# EAGLE schematic main (EAGLE 8.7.0)
CNAME: RJ Cunningham

## Sheet 1 of 11: Power Regulation A sheet for all the voltage regulators in use.
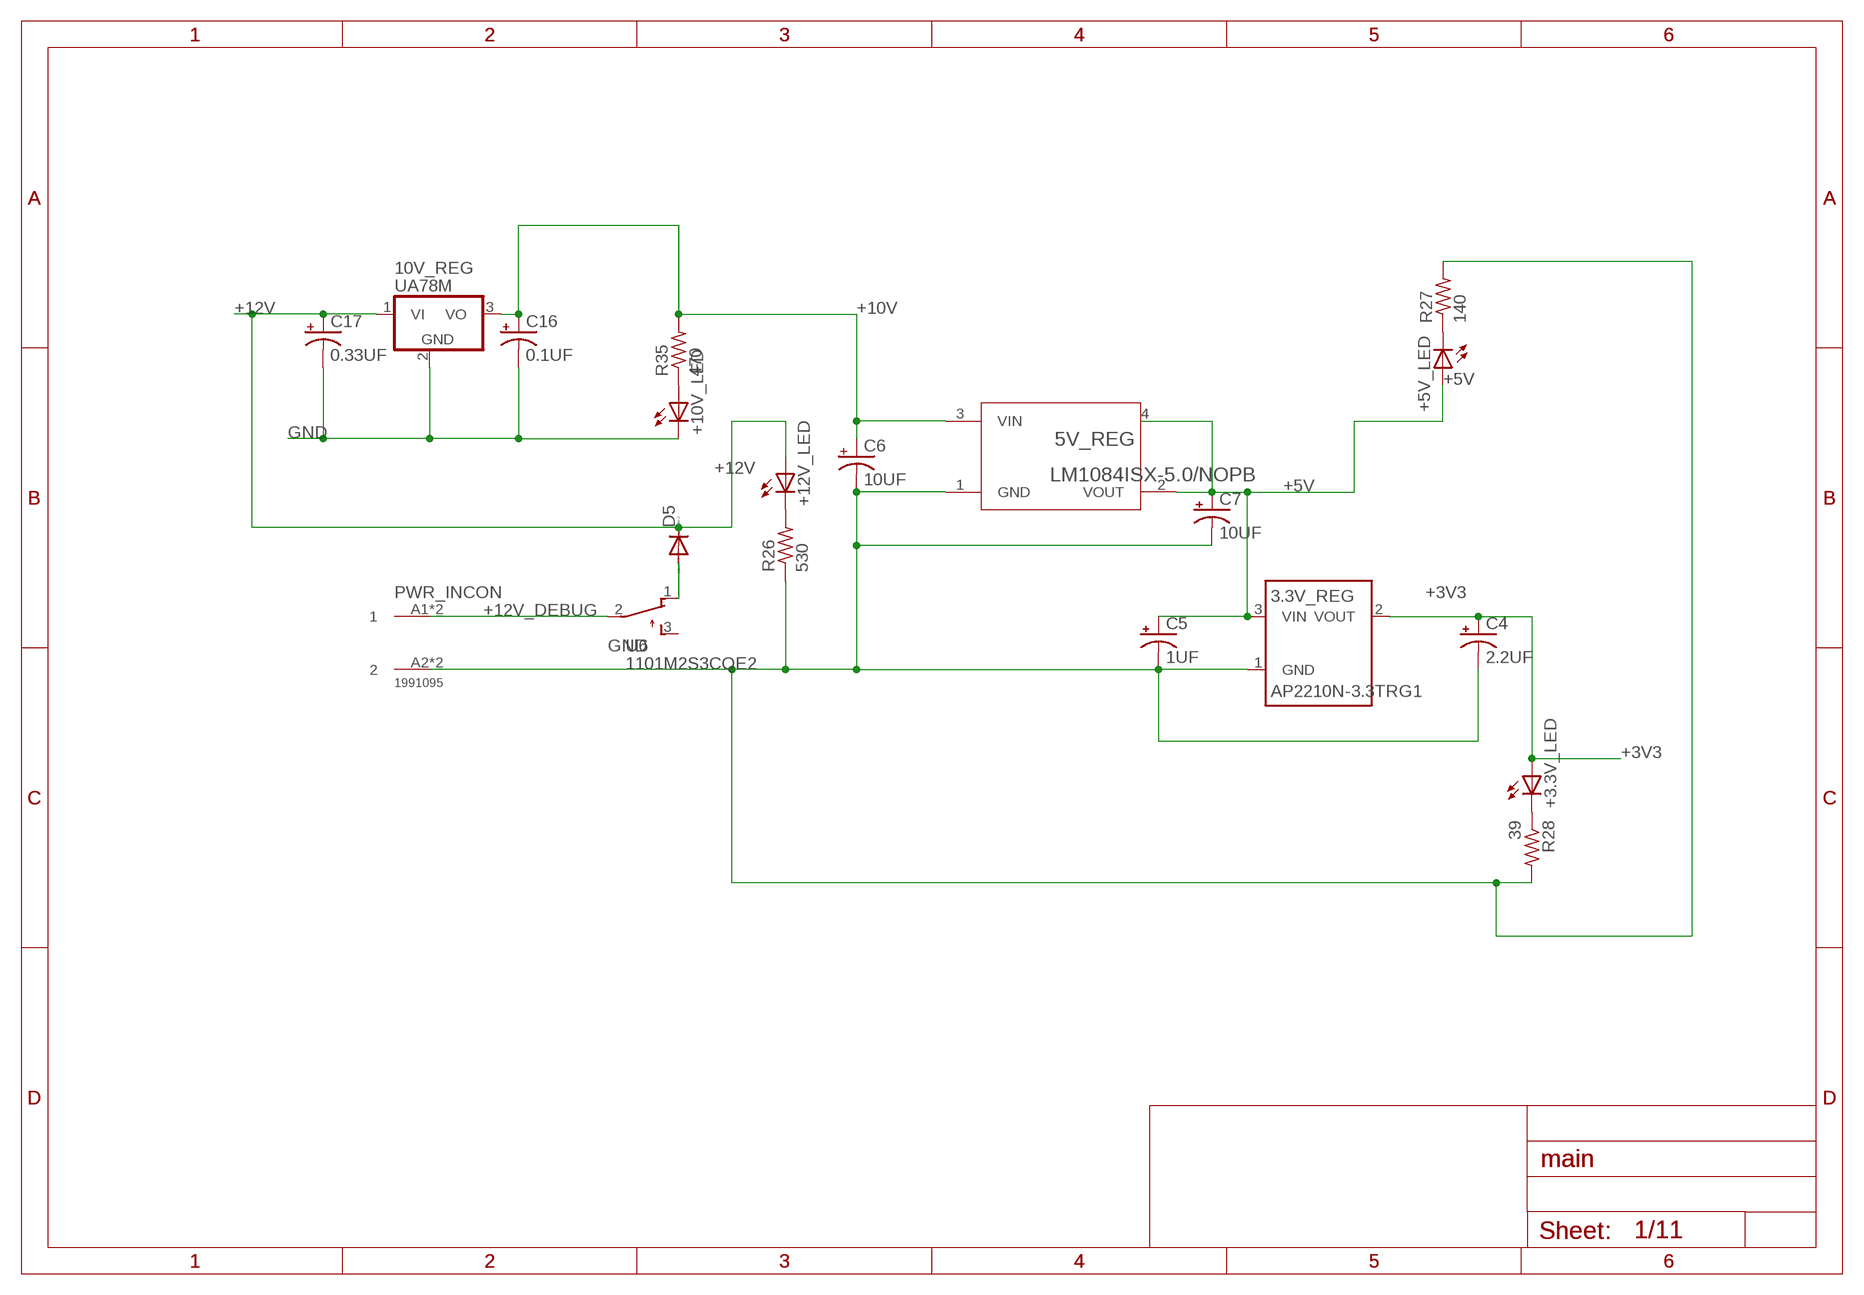
[diagram p0: schematic, sheet 1]

### Parts
3.3V_REG  AP2210N-3.3TRG1  [SOT23]
5V_REG  LM1084ISX-5.0/NOPB  [TS3B]
10V_REG  UA78M  [TO220S]
+3.3V_LED  LED5MM  [LED5MM]
+5V_LED  LED5MM  [LED5MM]
+10V_LED  LED5MM  [LED5MM]
+12V_LED  LED5MM  [LED5MM]
C4  2.2UF  CPOL-USE2.5-5  [E2,5-5]
C5  1UF  CPOL-USE2.5-5  [E2,5-5]
C6  10UF  CPOL-USE2.5-5  [E2,5-5]
C7  10UF  CPOL-USE2.5-5  [E2,5-5]
C16  0.1UF  CPOL-USE2.5-5  [E2,5-5]
C17  0.33UF  CPOL-USE2.5-5  [E2,5-5]
D5  DIODE-DO201-15  [DO201-15]
PWR_IN  1991095  [1991095]
R26  530  R-US_R0805  [R0805]
R27  140  R-US_R0805  [R0805]
R28  39  R-US_R0805  [R0805]
R35  470  R-US_R0805  [R0805]
U6  1101M2S3CQE2  [1101M2S3CQE2]

### Nets
+3V3: 3.3V_REG.2(VOUT) +3.3V_LED.A C4.+ ; also sheet 2,3,4,8,10
+5V: 3.3V_REG.3(VIN) 5V_REG.2(VOUT) 5V_REG.4 +5V_LED.A C5.+ C7.+ ; also sheet 7,8,9,10
+10V: 5V_REG.3(VIN) 10V_REG.3(VO) C6.+ C16.+ R35.2 ; also sheet 3,8,10
+12V: 10V_REG.1(VI) +12V_LED.A C17.+ D5.C ; also sheet 5,6,8,10
+12V_DEBUG: PWR_IN.A1 PWR_IN.B1 U6.2(P)
GND: 3.3V_REG.1(GND) 5V_REG.1(GND) 10V_REG.2(GND) +10V_LED.K(C) C4.- C5.- C6.- C7.- C16.- C17.- PWR_IN.A2 PWR_IN.B2 R26.1 R27.2 R28.2 ; also sheet 2,3,4,5,6,7,8,9,10
N$1: +12V_LED.K(C) R26.2
N$2: +5V_LED.K(C) R27.1
N$3: +3.3V_LED.K(C) R28.1
N$4: D5.A U6.1(O)
N$9: +10V_LED.A R35.1
Unconnected: U6.3(S)

## Sheet 2 of 11: Load Cell Amplification A schematic for amplifying signals from the load cells. Additional Level-Shifting circuits may be necessary, this is important as well.
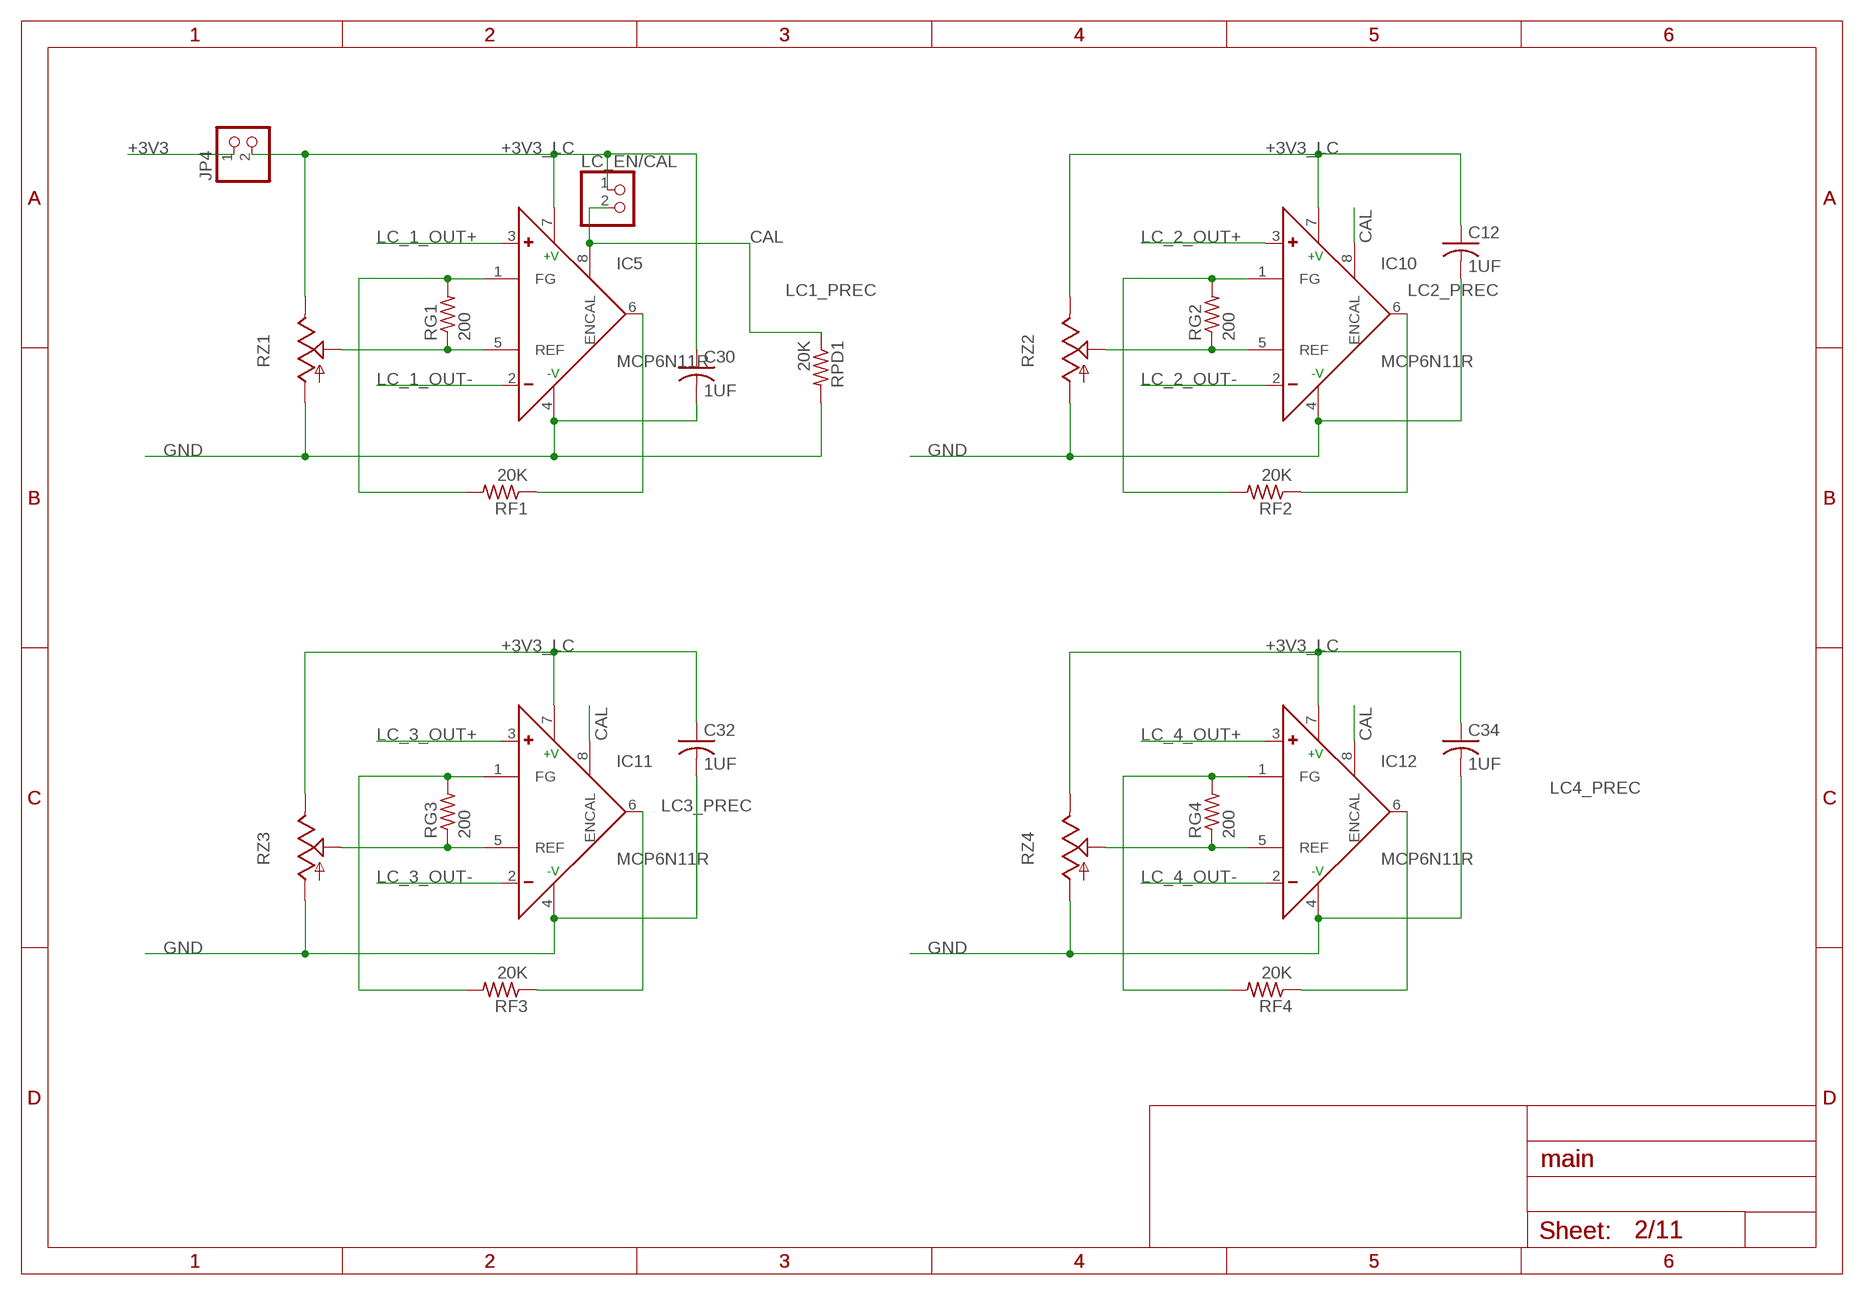
[diagram p1: schematic, sheet 2]

### Parts
C12  1UF  C-USC0805  [C0805]
C30  1UF  C-USC0805  [C0805]
C32  1UF  C-USC0805  [C0805]
C34  1UF  C-USC0805  [C0805]
IC5  MCP6N11R  [SO-8]
IC10  MCP6N11R  [SO-8]
IC11  MCP6N11R  [SO-8]
IC12  MCP6N11R  [SO-8]
JP4  PINHD-1X2  [1X02]
LC_EN/CAL  PINHD-1X2  [1X02]
RF1  20K  R-US_R0805  [R0805]
RF2  20K  R-US_R0805  [R0805]
RF3  20K  R-US_R0805  [R0805]
RF4  20K  R-US_R0805  [R0805]
RG1  200  R-US_R0805  [R0805]
RG2  200  R-US_R0805  [R0805]
RG3  200  R-US_R0805  [R0805]
RG4  200  R-US_R0805  [R0805]
RPD1  20K  R-US_R0805  [R0805]
RZ1  TRIM_US-S64W  [S64W]
RZ2  TRIM_US-S64W  [S64W]
RZ3  TRIM_US-S64W  [S64W]
RZ4  TRIM_US-S64W  [S64W]

### Nets
+3V3: JP4.1 ; also sheet 1,3,4,8,10
+3V3_LC: C12.1 C30.1 C32.1 C34.1 IC5.7(+V) IC10.7(+V) IC11.7(+V) IC12.7(+V) JP4.2 LC_EN/CAL.1 RZ1.E RZ2.E RZ3.E RZ4.E
CAL: IC5.8(ENCAL) IC10.8(ENCAL) IC11.8(ENCAL) IC12.8(ENCAL) LC_EN/CAL.2 RPD1.1
GND: C12.2 C30.2 C32.2 C34.2 IC5.4(-V) IC10.4(-V) IC11.4(-V) IC12.4(-V) RPD1.2 RZ1.A RZ2.A RZ3.A RZ4.A ; also sheet 1,3,4,5,6,7,8,9,10
LC1_PREC: IC5.6(OUT) RF1.1 ; also sheet 9
LC2_PREC: IC10.6(OUT) RF2.1 ; also sheet 9
LC3_PREC: IC11.6(OUT) RF3.1 ; also sheet 9
LC4_PREC: IC12.6(OUT) RF4.1 ; also sheet 9
LC_1_OUT+: IC5.3(+) ; also sheet 8
LC_1_OUT-: IC5.2(-) ; also sheet 8
LC_2_OUT+: IC10.3(+) ; also sheet 8
LC_2_OUT-: IC10.2(-) ; also sheet 8
LC_3_OUT+: IC11.3(+) ; also sheet 8
LC_3_OUT-: IC11.2(-) ; also sheet 8
LC_4_OUT+: IC12.3(+) ; also sheet 8
LC_4_OUT-: IC12.2(-) ; also sheet 8
N$21: IC10.1(FG) RF2.2 RG2.2
N$22: IC10.5(REF) RG2.1 RZ2.S
N$39: IC11.1(FG) RF3.2 RG3.2
N$41: IC5.1(FG) RF1.2 RG1.2
N$42: IC5.5(REF) RG1.1 RZ1.S
N$43: IC11.5(REF) RG3.1 RZ3.S
N$46: IC12.1(FG) RF4.2 RG4.2
N$47: IC12.5(REF) RG4.1 RZ4.S

## Sheet 3 of 11: PT Amplification Circuits for measuring PT
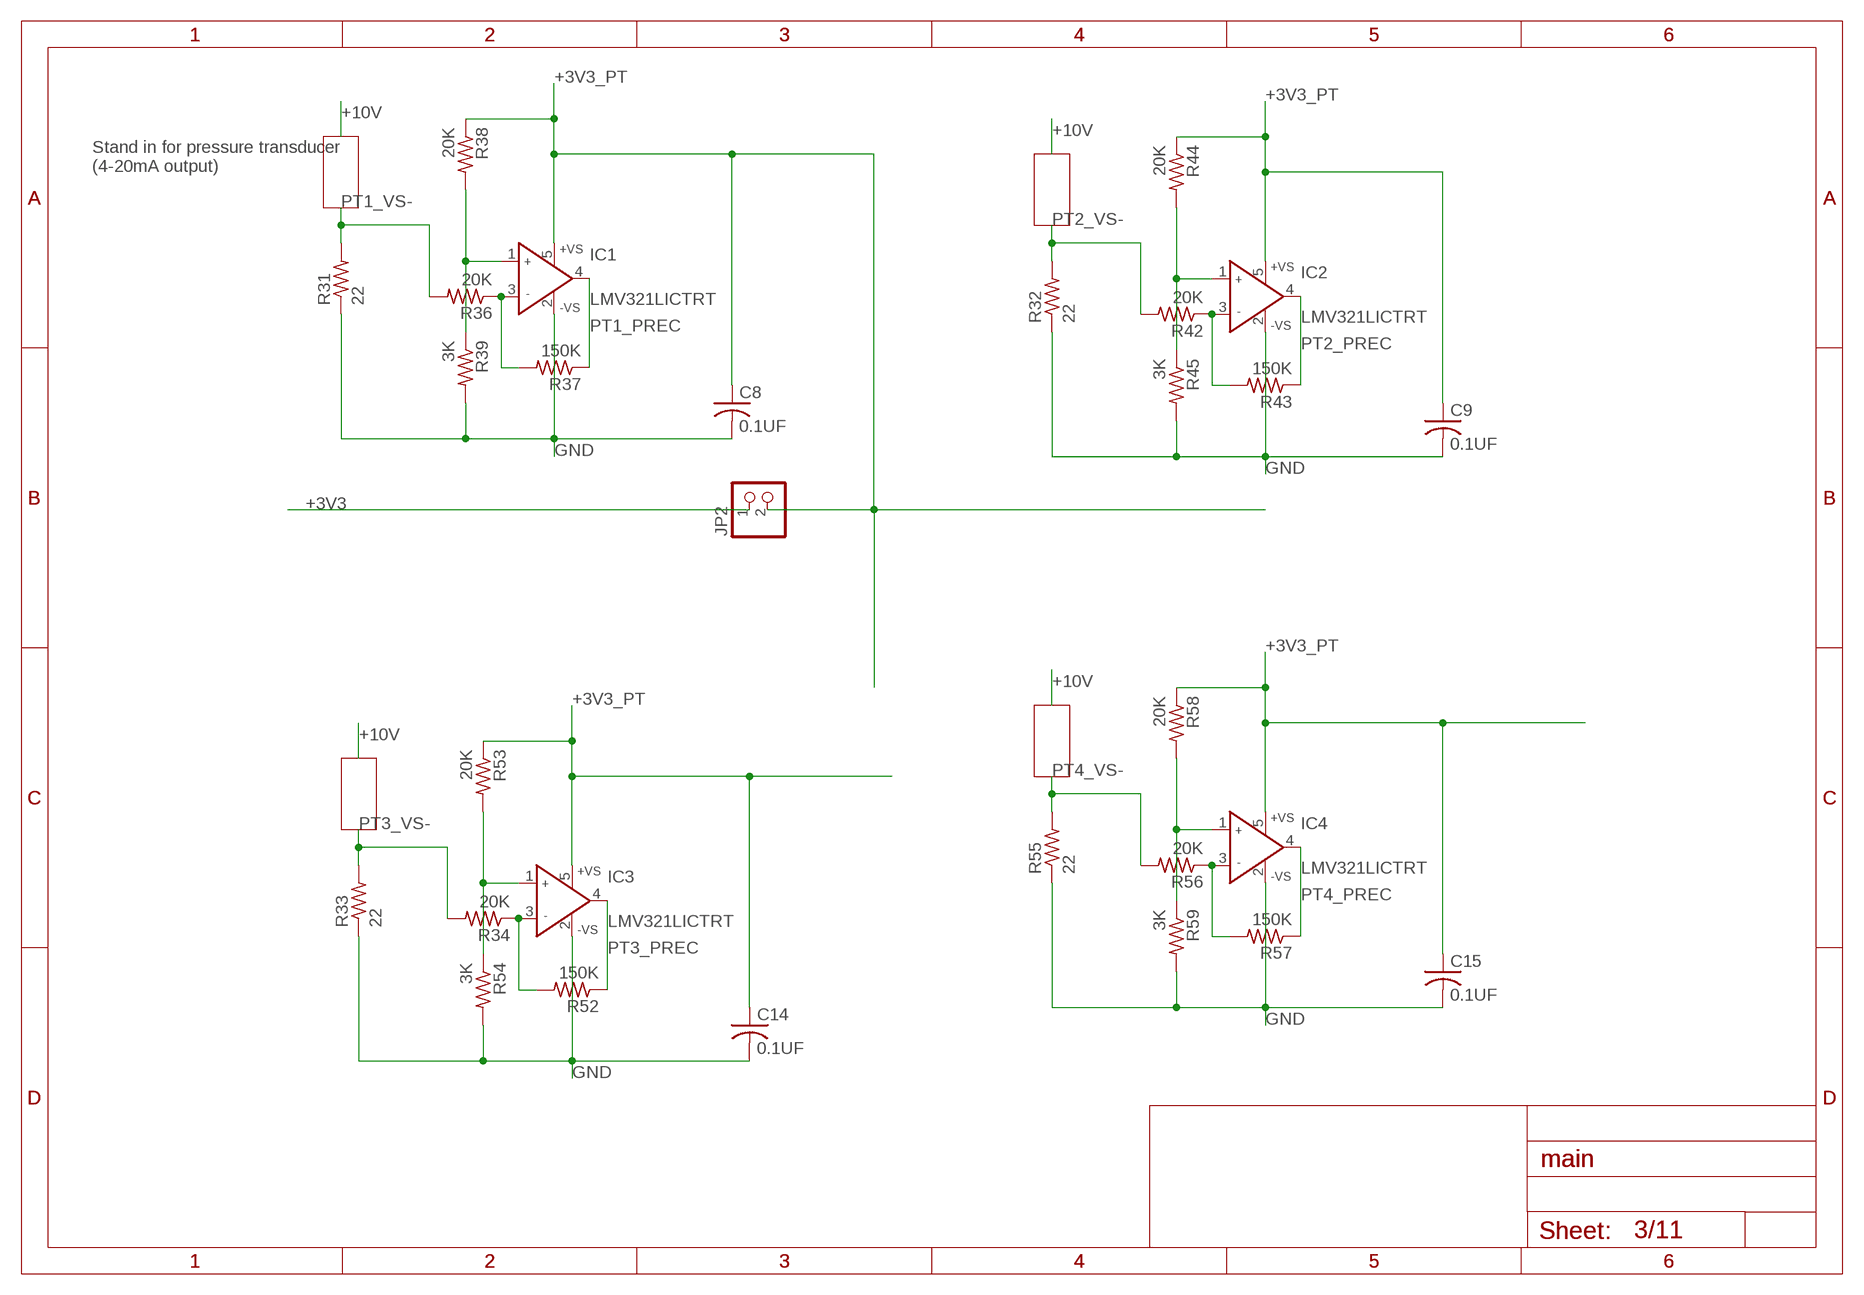
[diagram p2: schematic, sheet 3]

### Parts
C8  0.1UF  C-USC0805  [C0805]
C9  0.1UF  C-USC0805  [C0805]
C14  0.1UF  C-USC0805  [C0805]
C15  0.1UF  C-USC0805  [C0805]
IC1  LMV321LICTRT  [SOT23-5]
IC2  LMV321LICTRT  [SOT23-5]
IC3  LMV321LICTRT  [SOT23-5]
IC4  LMV321LICTRT  [SOT23-5]
JP2  PINHD-1X2  [1X02]
R31  22  R-US_R0805  [R0805]
R32  22  R-US_R0805  [R0805]
R33  22  R-US_R0805  [R0805]
R34  20K  R-US_R0805  [R0805]
R36  20K  R-US_R0805  [R0805]
R37  150K  R-US_R0805  [R0805]
R38  20K  R-US_R0805  [R0805]
R39  3K  R-US_R0805  [R0805]
R42  20K  R-US_R0805  [R0805]
R43  150K  R-US_R0805  [R0805]
R44  20K  R-US_R0805  [R0805]
R45  3K  R-US_R0805  [R0805]
R52  150K  R-US_R0805  [R0805]
R53  20K  R-US_R0805  [R0805]
R54  3K  R-US_R0805  [R0805]
R55  22  R-US_R0805  [R0805]
R56  20K  R-US_R0805  [R0805]
R57  150K  R-US_R0805  [R0805]
R58  20K  R-US_R0805  [R0805]
R59  3K  R-US_R0805  [R0805]

### Nets
+3V3: JP2.1 ; also sheet 1,2,4,8,10
+3V3_PT: C8.1 C9.1 C14.1 C15.1 IC1.5(+VS) IC2.5(+VS) IC3.5(+VS) IC4.5(+VS) JP2.2 R38.1 R44.1 R53.1 R58.1
GND: C8.2 C9.2 C14.2 C15.2 IC1.2(-VS) IC2.2(-VS) IC3.2(-VS) IC4.2(-VS) R31.1 R32.1 R33.1 R39.2 R45.2 R54.2 R55.1 R59.2 ; also sheet 1,2,4,5,6,7,8,9,10
N$10: IC1.3(IN-) R36.1 R37.2
N$12: IC1.1(IN+) R38.2 R39.1
N$26: IC2.3(IN-) R42.1 R43.2
N$27: IC2.1(IN+) R44.2 R45.1
N$34: IC3.3(IN-) R34.1 R52.2
N$35: IC3.1(IN+) R53.2 R54.1
N$36: IC4.3(IN-) R56.1 R57.2
N$37: IC4.1(IN+) R58.2 R59.1
PT1_PREC: IC1.4(OUT) R37.1 ; also sheet 7
PT1_VS-: R31.2 R36.2 ; also sheet 8
PT2_PREC: IC2.4(OUT) R43.1 ; also sheet 7
PT2_VS-: R32.2 R42.2 ; also sheet 8
PT3_PREC: IC3.4(OUT) R52.1 ; also sheet 7
PT3_VS-: R33.2 R34.2 ; also sheet 8
PT4_PREC: IC4.4(OUT) R57.1 ; also sheet 7
PT4_VS-: R55.2 R56.2 ; also sheet 8

### Notes on the sheet
- Stand in for pressure transducer
  (4-20mA output)

## Sheet 4 of 11: ADC The updated schematic for the adc because the old one is on backorder.
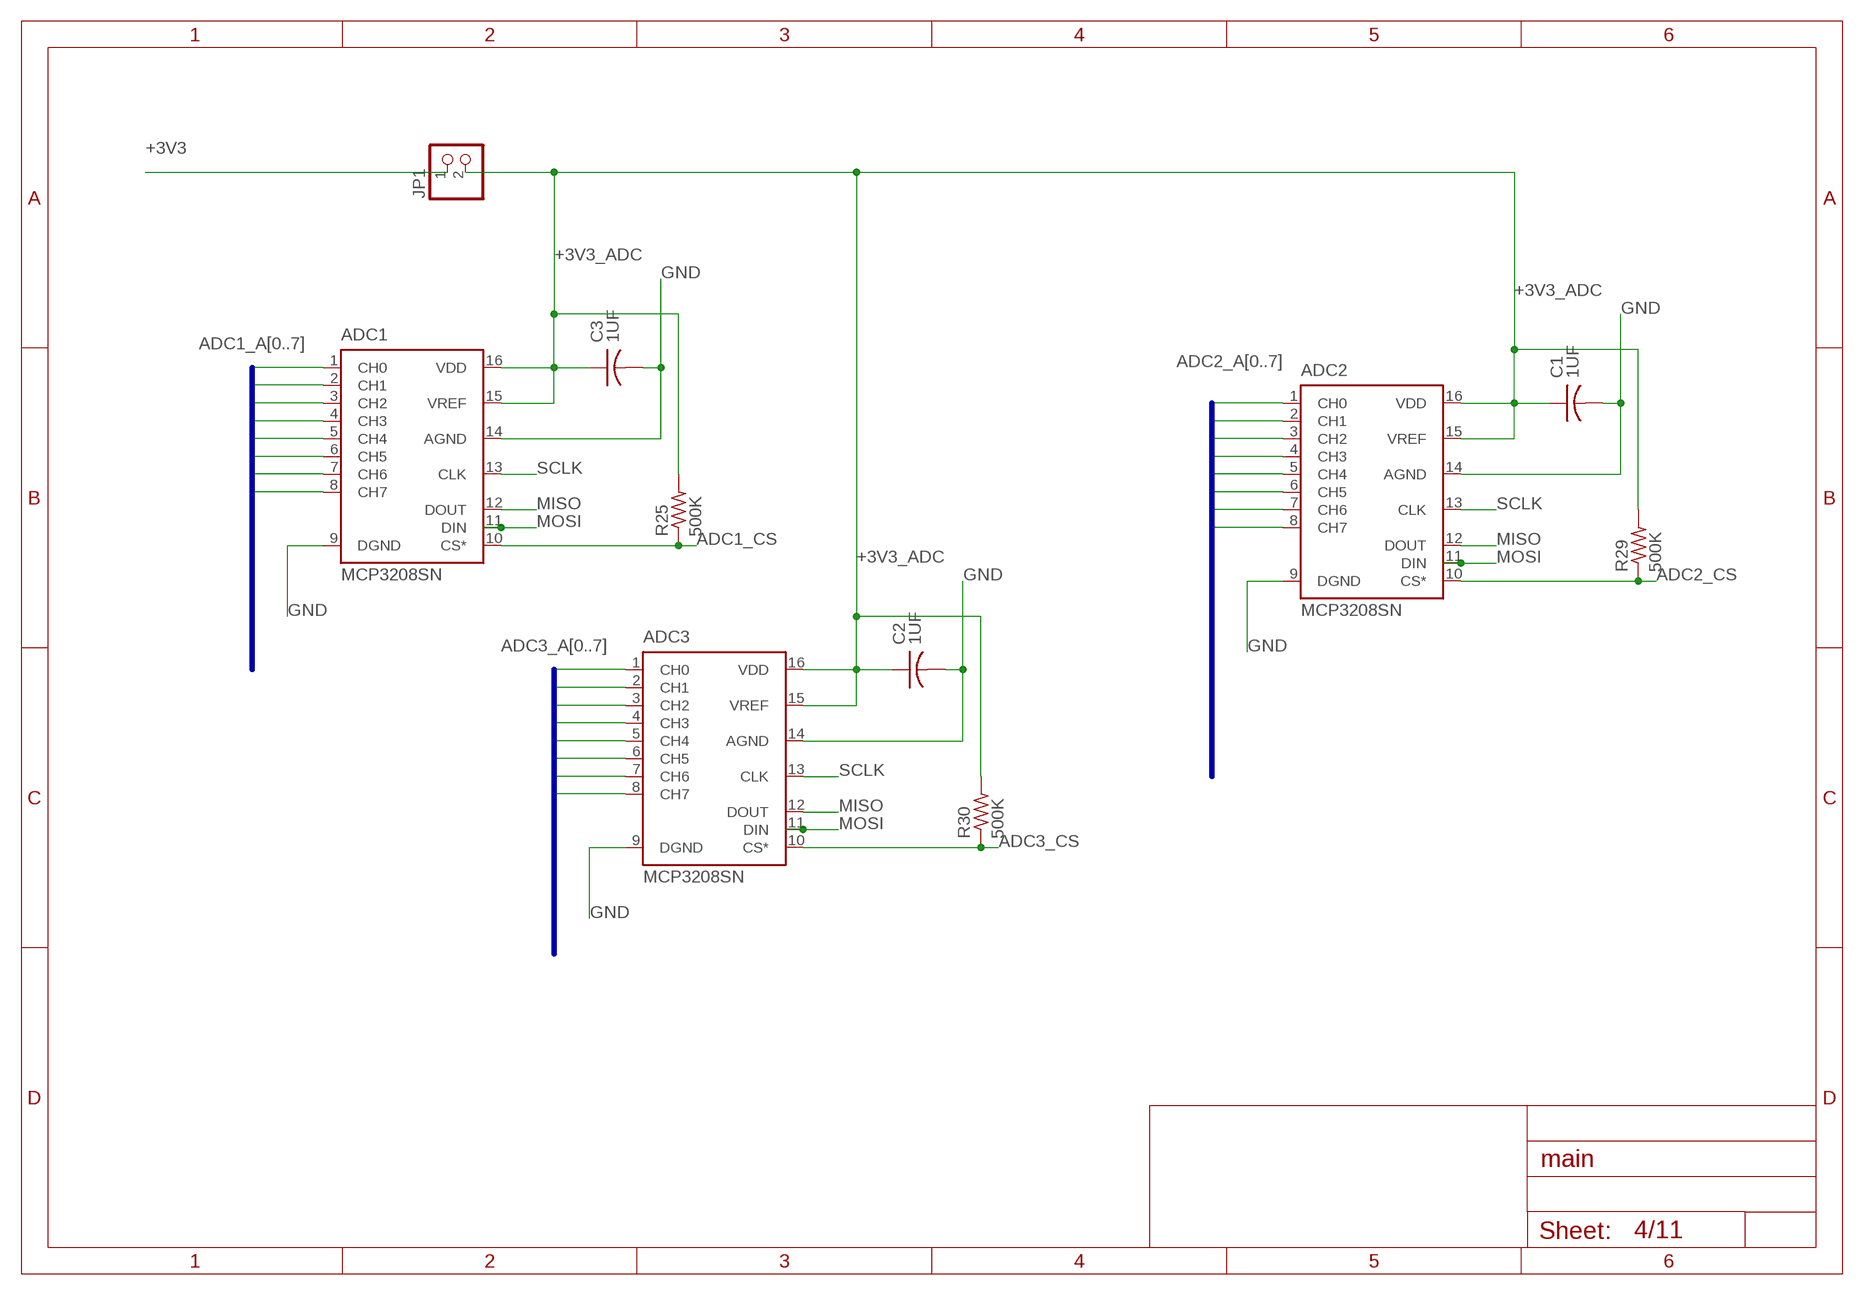
[diagram p3: schematic, sheet 4]

### Parts
ADC1  MCP3208SN  [SO-16]
ADC2  MCP3208SN  [SO-16]
ADC3  MCP3208SN  [SO-16]
C1  1UF  C-USC0805  [C0805]
C2  1UF  C-USC0805  [C0805]
C3  1UF  C-USC0805  [C0805]
JP1  PINHD-1X2  [1X02]
R25  500K  R-US_R0805  [R0805]
R29  500K  R-US_R0805  [R0805]
R30  500K  R-US_R0805  [R0805]

### Nets
+3V3: JP1.1 ; also sheet 1,2,3,8,10
+3V3_ADC: ADC1.15(VREF) ADC1.16(VDD) ADC2.15(VREF) ADC2.16(VDD) ADC3.15(VREF) ADC3.16(VDD) C1.1 C2.1 C3.1 JP1.2 R25.2 R29.2 R30.2
ADC1_A0: ADC1.1(CH0) ; also sheet 9,10
ADC1_A1: ADC1.2(CH1) ; also sheet 9,10
ADC1_A2: ADC1.3(CH2) ; also sheet 10
ADC1_A3: ADC1.4(CH3) ; also sheet 9,10
ADC1_A4: ADC1.5(CH4) ; also sheet 9,10
ADC1_A5: ADC1.6(CH5) ; also sheet 9,10
ADC1_A6: ADC1.7(CH6) ; also sheet 10
ADC1_A7: ADC1.8(CH7) ; also sheet 10
ADC1_CS: ADC1.10(CS*) R25.1 ; also sheet 8,10
ADC2_A0: ADC2.1(CH0) ; also sheet 7,10
ADC2_A1: ADC2.2(CH1) ; also sheet 7,10
ADC2_A2: ADC2.3(CH2) ; also sheet 7,10
ADC2_A3: ADC2.4(CH3) ; also sheet 7,10
ADC2_A4: ADC2.5(CH4) ; also sheet 8,10
ADC2_A5: ADC2.6(CH5) ; also sheet 8,10
ADC2_A6: ADC2.7(CH6) ; also sheet 8,10
ADC2_A7: ADC2.8(CH7) ; also sheet 8,10
ADC2_CS: ADC2.10(CS*) R29.1 ; also sheet 8,10
ADC3_A0: ADC3.1(CH0) ; also sheet 10
ADC3_A1: ADC3.2(CH1) ; also sheet 10
ADC3_A2: ADC3.3(CH2) ; also sheet 10
ADC3_A3: ADC3.4(CH3) ; also sheet 10
ADC3_A4: ADC3.5(CH4) ; also sheet 10
ADC3_A5: ADC3.6(CH5) ; also sheet 10
ADC3_A6: ADC3.7(CH6) ; also sheet 10
ADC3_A7: ADC3.8(CH7) ; also sheet 10
ADC3_CS: ADC3.10(CS*) R30.1 ; also sheet 8,10
GND: ADC1.9(DGND) ADC1.14(AGND) ADC2.9(DGND) ADC2.14(AGND) ADC3.9(DGND) ADC3.14(AGND) C1.2 C2.2 C3.2 ; also sheet 1,2,3,5,6,7,8,9,10
MISO: ADC1.12(DOUT) ADC2.12(DOUT) ADC3.12(DOUT) ; also sheet 8,10
MOSI: ADC1.11(DIN) ADC2.11(DIN) ADC3.11(DIN) ; also sheet 8,10
SCLK: ADC1.13(CLK) ADC2.13(CLK) ADC3.13(CLK) ; also sheet 8,10

### Buses
ADC1_A[0..7]
ADC2_A[0..7]
ADC3_A[0..7]

## Sheet 5 of 11: Solenoid Driver A circuit that controls the driver for the solenoid.
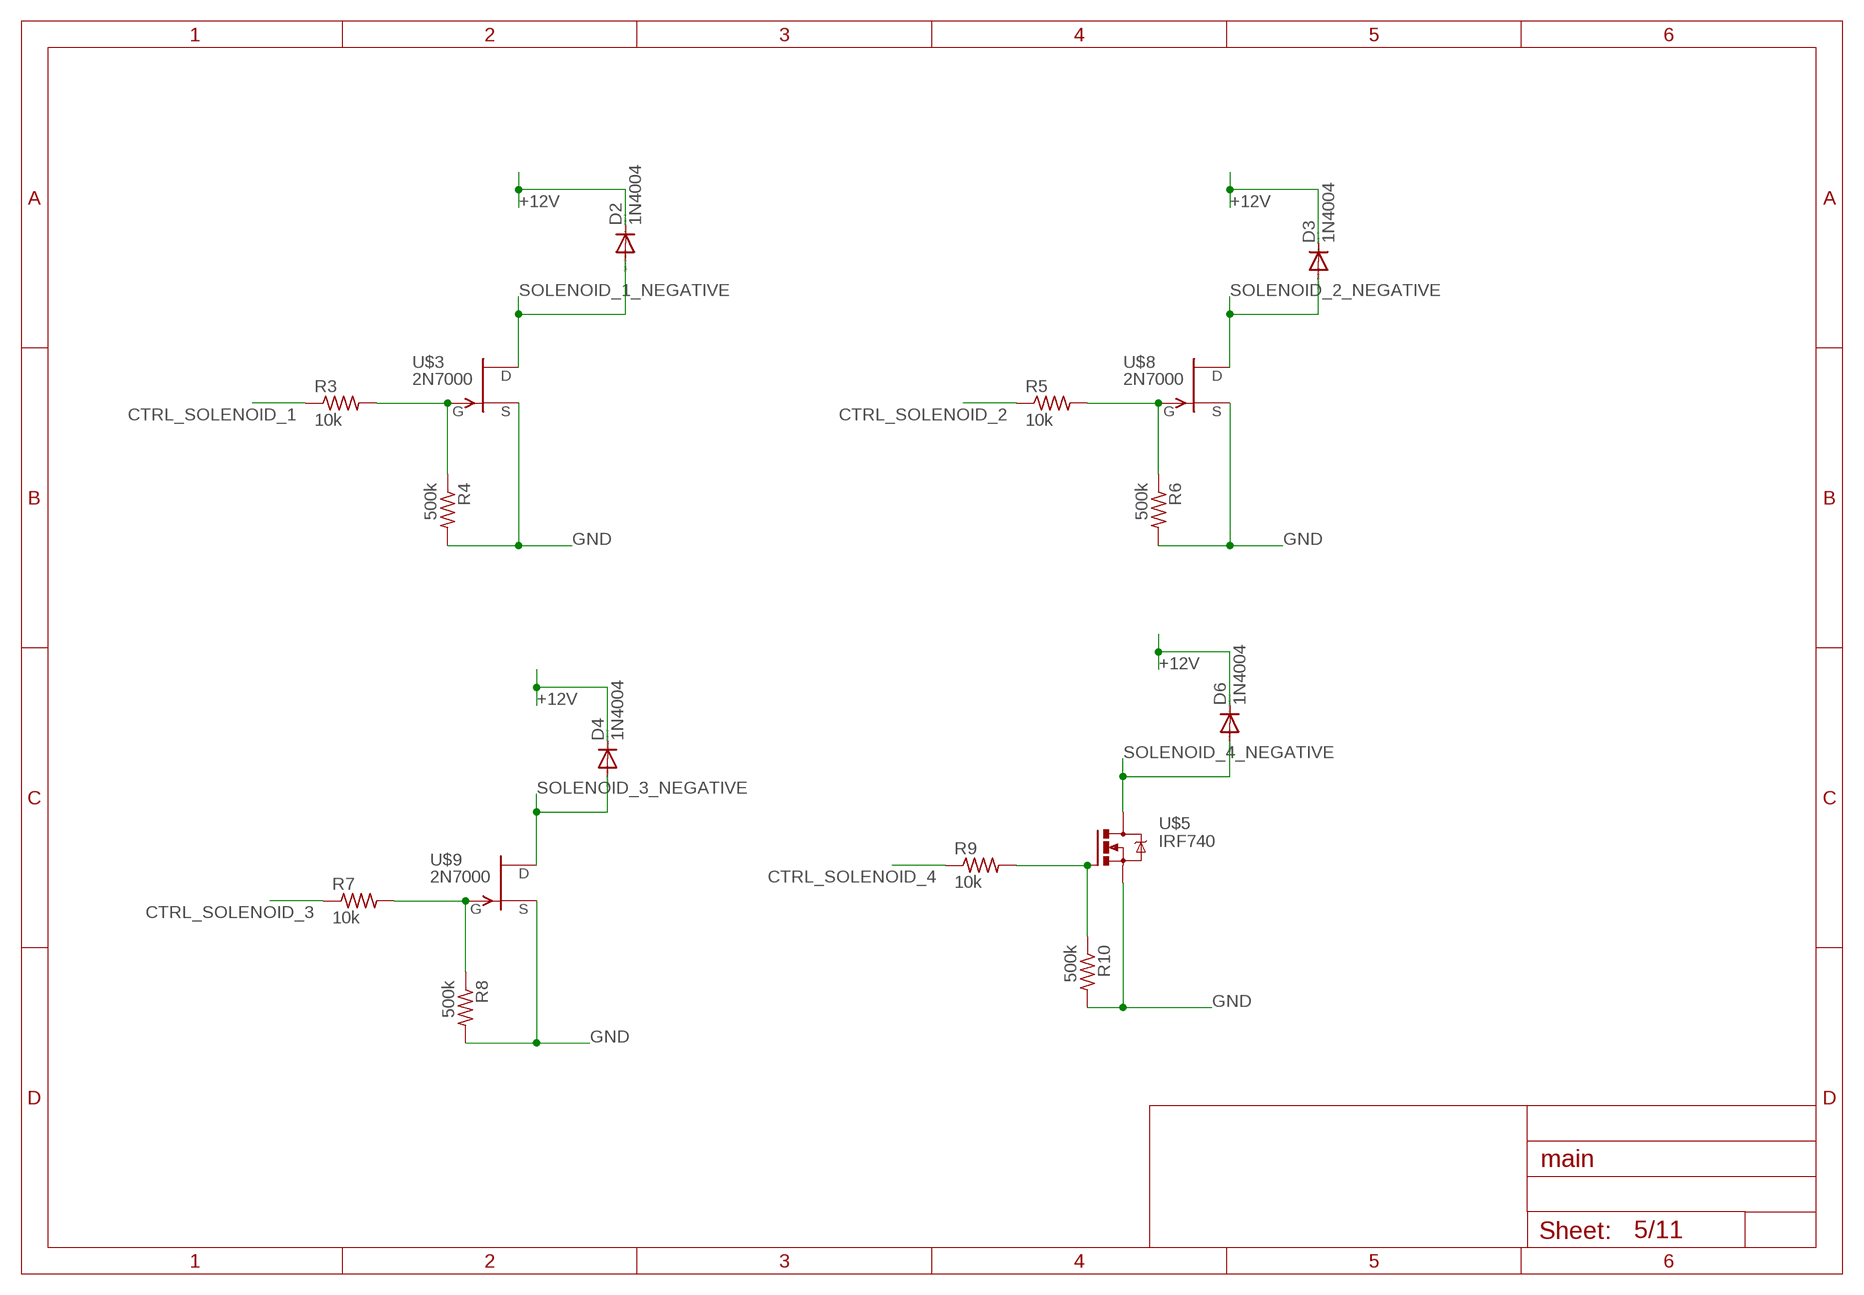
[diagram p4: schematic, sheet 5]

### Parts
D2  1N4004  [DO41-10]
D3  1N4004  [DO41-10]
D4  1N4004  [DO41-10]
D6  1N4004  [DO41-10]
R3  10k  R-US_R0805  [R0805]
R4  500k  R-US_R0805  [R0805]
R5  10k  R-US_R0805  [R0805]
R6  500k  R-US_R0805  [R0805]
R7  10k  R-US_R0805  [R0805]
R8  500k  R-US_R0805  [R0805]
R9  10k  R-US_R0805  [R0805]
R10  500k  R-US_R0805  [R0805]
U$3  2N7000  [SOT23]
U$5  IRF740  [TO220BV]
U$8  2N7000  [SOT23]
U$9  2N7000  [SOT23]

### Nets
+12V: D2.C D3.C D4.C D6.C ; also sheet 1,6,8,10
CTRL_SOLENOID_1: R3.1 ; also sheet 8
CTRL_SOLENOID_2: R5.1 ; also sheet 8
CTRL_SOLENOID_3: R7.1 ; also sheet 8
CTRL_SOLENOID_4: R9.1 ; also sheet 8
GND: R4.2 R6.2 R8.2 R10.2 U$3.2(S) U$5.S U$8.2(S) U$9.2(S) ; also sheet 1,2,3,4,6,7,8,9,10
N$6: R3.2 R4.1 U$3.1(G)
N$7: R5.2 R6.1 U$8.1(G)
N$8: R7.2 R8.1 U$9.1(G)
N$14: R9.2 R10.1 U$5.G
SOLENOID_1_NEGATIVE: D2.A U$3.3(D) ; also sheet 8
SOLENOID_2_NEGATIVE: D3.A U$8.3(D) ; also sheet 8
SOLENOID_3_NEGATIVE: D4.A U$9.3(D) ; also sheet 8
SOLENOID_4_NEGATIVE: D6.A U$5.D ; also sheet 8

## Sheet 6 of 11: Ignition Driver A circuit that controls the relay for the igniter.
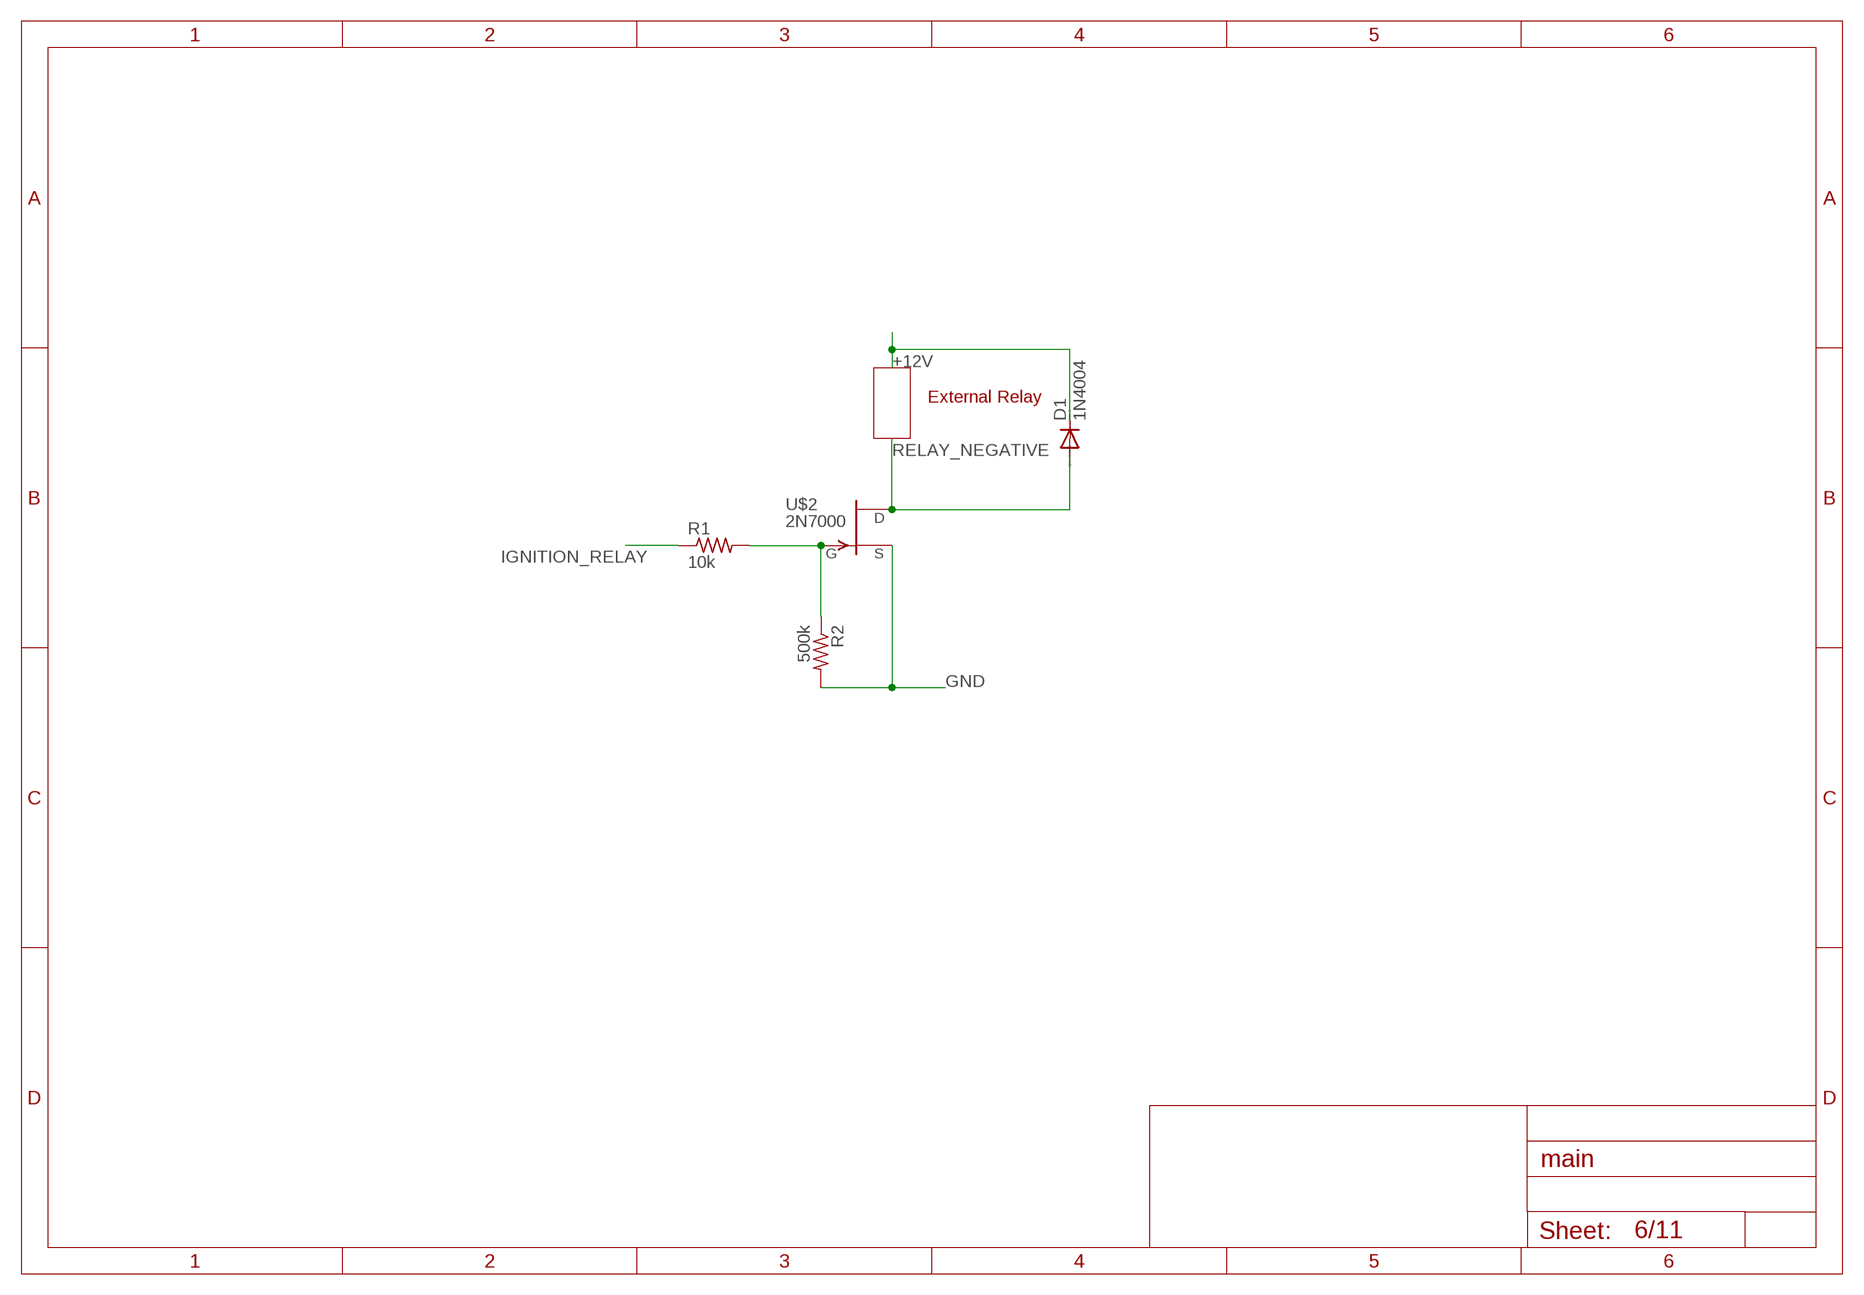
[diagram p5: schematic, sheet 6]

### Parts
D1  1N4004  [DO41-10]
R1  10k  R-US_R0805  [R0805]
R2  500k  R-US_R0805  [R0805]
U$2  2N7000  [SOT23]

### Nets
+12V: D1.C ; also sheet 1,5,8,10
GND: R2.2 U$2.2(S) ; also sheet 1,2,3,4,5,7,8,9,10
IGNITION_RELAY: R1.1 ; also sheet 8
N$5: R1.2 R2.1 U$2.1(G)
RELAY_NEGATIVE: D1.A U$2.3(D) ; also sheet 8

### Notes on the sheet
- External Relay

## Sheet 7 of 11: Anti-Aliasing Circuits used for anti-aliasing all sampled signals. May need to be split across multiple sheets. If so, feel free to do so.
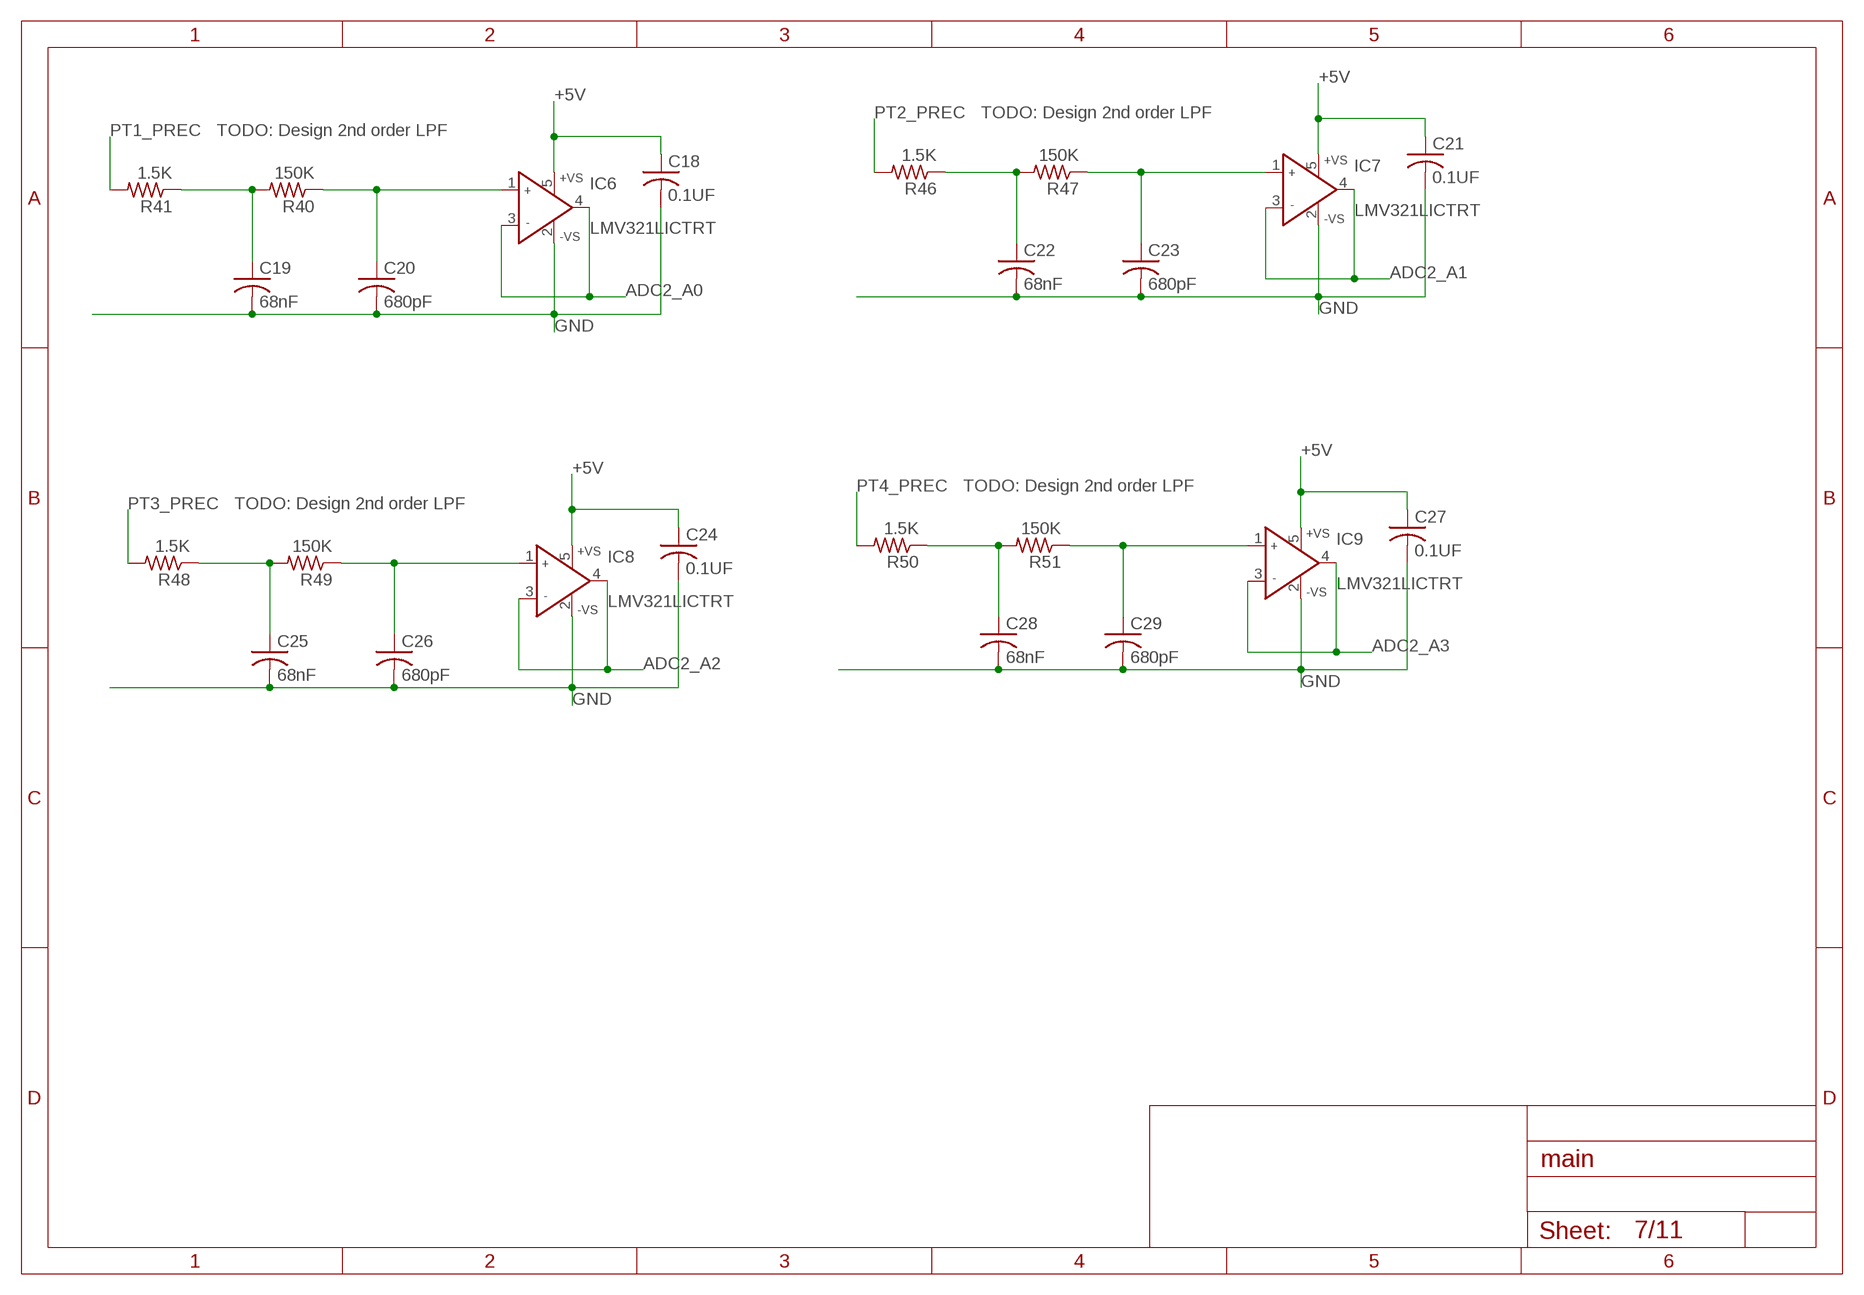
[diagram p6: schematic, sheet 7]

### Parts
C18  0.1UF  C-USC0805  [C0805]
C19  68nF  C-USC0805  [C0805]
C20  680pF  C-USC0805  [C0805]
C21  0.1UF  C-USC0805  [C0805]
C22  68nF  C-USC0805  [C0805]
C23  680pF  C-USC0805  [C0805]
C24  0.1UF  C-USC0805  [C0805]
C25  68nF  C-USC0805  [C0805]
C26  680pF  C-USC0805  [C0805]
C27  0.1UF  C-USC0805  [C0805]
C28  68nF  C-USC0805  [C0805]
C29  680pF  C-USC0805  [C0805]
IC6  LMV321LICTRT  [SOT23-5]
IC7  LMV321LICTRT  [SOT23-5]
IC8  LMV321LICTRT  [SOT23-5]
IC9  LMV321LICTRT  [SOT23-5]
R40  150K  R-US_R0805  [R0805]
R41  1.5K  R-US_R0805  [R0805]
R46  1.5K  R-US_R0805  [R0805]
R47  150K  R-US_R0805  [R0805]
R48  1.5K  R-US_R0805  [R0805]
R49  150K  R-US_R0805  [R0805]
R50  1.5K  R-US_R0805  [R0805]
R51  150K  R-US_R0805  [R0805]

### Nets
+5V: C18.1 C21.1 C24.1 C27.1 IC6.5(+VS) IC7.5(+VS) IC8.5(+VS) IC9.5(+VS) ; also sheet 1,8,9,10
ADC2_A0: IC6.3(IN-) IC6.4(OUT) ; also sheet 4,10
ADC2_A1: IC7.3(IN-) IC7.4(OUT) ; also sheet 4,10
ADC2_A2: IC8.3(IN-) IC8.4(OUT) ; also sheet 4,10
ADC2_A3: IC9.3(IN-) IC9.4(OUT) ; also sheet 4,10
GND: C18.2 C19.2 C20.2 C21.2 C22.2 C23.2 C24.2 C25.2 C26.2 C27.2 C28.2 C29.2 IC6.2(-VS) IC7.2(-VS) IC8.2(-VS) IC9.2(-VS) ; also sheet 1,2,3,4,5,6,8,9,10
N$11: C19.1 R40.2 R41.1
N$25: C20.1 IC6.1(IN+) R40.1
N$28: C22.1 R46.1 R47.2
N$29: C23.1 IC7.1(IN+) R47.1
N$30: C25.1 R48.1 R49.2
N$31: C26.1 IC8.1(IN+) R49.1
N$32: C28.1 R50.1 R51.2
N$33: C29.1 IC9.1(IN+) R51.1
PT1_PREC: R41.2 ; also sheet 3
PT2_PREC: R46.2 ; also sheet 3
PT3_PREC: R48.2 ; also sheet 3
PT4_PREC: R50.2 ; also sheet 3

### Notes on the sheet
- TODO: Design 2nd order LPF
- TODO: Design 2nd order LPF
- TODO: Design 2nd order LPF
- TODO: Design 2nd order LPF

## Sheet 8 of 11: External Connectors All the external connectors used on the board.
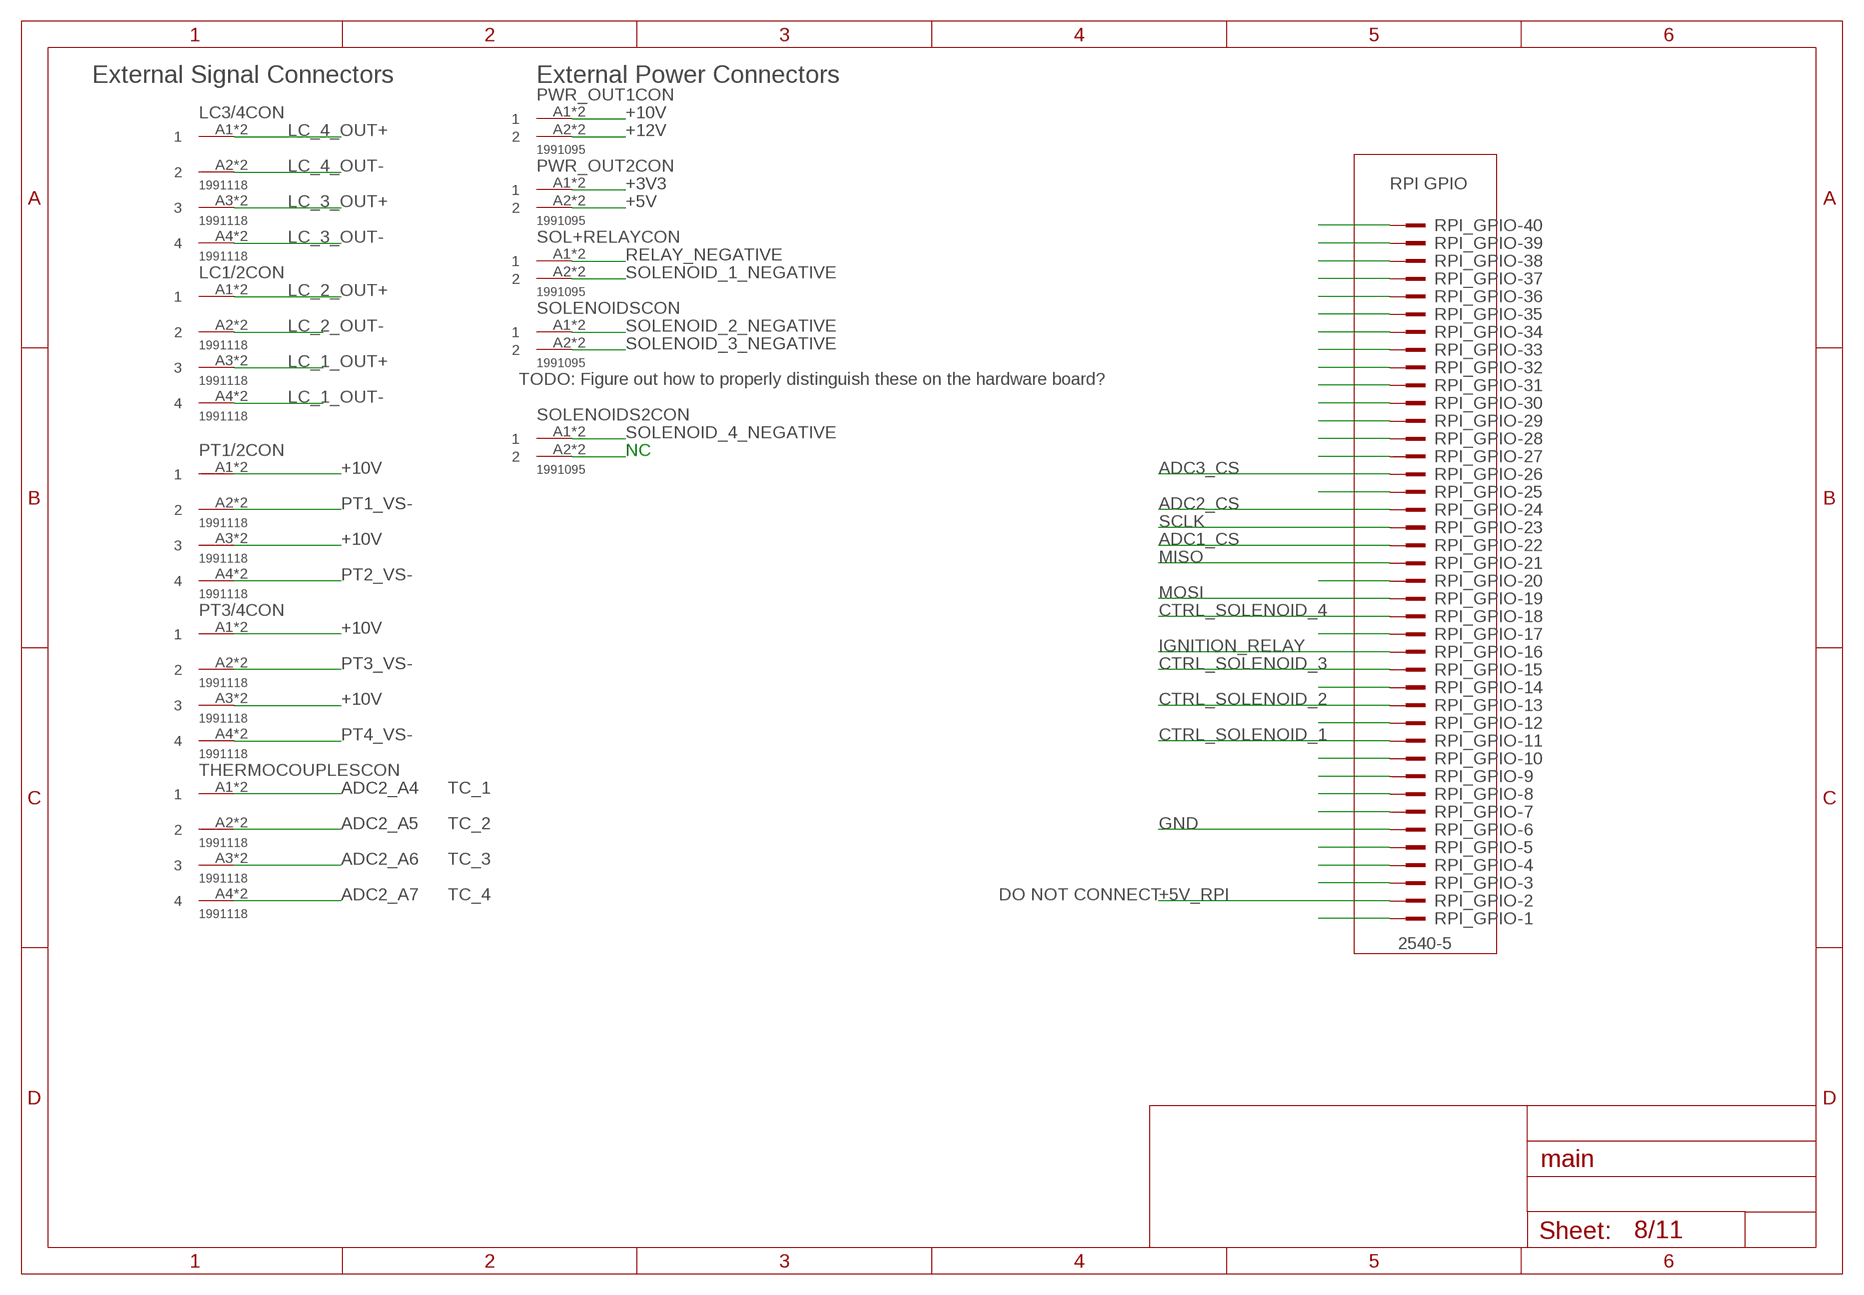
[diagram p7: schematic, sheet 8]

### Parts
LC1/2  1991118  [1991118]
LC3/4  1991118  [1991118]
PT1/2  1991118  [1991118]
PT3/4  1991118  [1991118]
PWR_OUT1  1991095  [1991095]
PWR_OUT2  1991095  [1991095]
RPI_GPIO  2540-5  [PAK100/2500-5-40]
SOL+RELAY  1991095  [1991095]
SOLENOIDS  1991095  [1991095]
SOLENOIDS2  1991095  [1991095]
THERMOCOUPLES  1991118  [1991118]

### Nets
+3V3: PWR_OUT2.A1 PWR_OUT2.B1 ; also sheet 1,2,3,4,10
+5V: PWR_OUT2.A2 PWR_OUT2.B2 ; also sheet 1,7,9,10
+5V_RPI: RPI_GPIO.2
+10V: PT1/2.A1 PT1/2.A3 PT1/2.B1 PT1/2.B3 PT3/4.A1 PT3/4.A3 PT3/4.B1 PT3/4.B3 PWR_OUT1.A1 PWR_OUT1.B1 ; also sheet 1,3,10
+12V: PWR_OUT1.A2 PWR_OUT1.B2 ; also sheet 1,5,6,10
ADC1_CS: RPI_GPIO.22 ; also sheet 4,10
ADC2_A4: THERMOCOUPLES.A1 THERMOCOUPLES.B1 ; also sheet 4,10
ADC2_A5: THERMOCOUPLES.A2 THERMOCOUPLES.B2 ; also sheet 4,10
ADC2_A6: THERMOCOUPLES.A3 THERMOCOUPLES.B3 ; also sheet 4,10
ADC2_A7: THERMOCOUPLES.A4 THERMOCOUPLES.B4 ; also sheet 4,10
ADC2_CS: RPI_GPIO.24 ; also sheet 4,10
ADC3_CS: RPI_GPIO.26 ; also sheet 4,10
CTRL_SOLENOID_1: RPI_GPIO.11 ; also sheet 5
CTRL_SOLENOID_2: RPI_GPIO.13 ; also sheet 5
CTRL_SOLENOID_3: RPI_GPIO.15 ; also sheet 5
CTRL_SOLENOID_4: RPI_GPIO.18 ; also sheet 5
GND: RPI_GPIO.6 ; also sheet 1,2,3,4,5,6,7,9,10
IGNITION_RELAY: RPI_GPIO.16 ; also sheet 6
LC_1_OUT+: LC1/2.A3 LC1/2.B3 ; also sheet 2
LC_1_OUT-: LC1/2.A4 LC1/2.B4 ; also sheet 2
LC_2_OUT+: LC1/2.A1 LC1/2.B1 ; also sheet 2
LC_2_OUT-: LC1/2.A2 LC1/2.B2 ; also sheet 2
LC_3_OUT+: LC3/4.A3 LC3/4.B3 ; also sheet 2
LC_3_OUT-: LC3/4.A4 LC3/4.B4 ; also sheet 2
LC_4_OUT+: LC3/4.A1 LC3/4.B1 ; also sheet 2
LC_4_OUT-: LC3/4.A2 LC3/4.B2 ; also sheet 2
MISO: RPI_GPIO.21 ; also sheet 4,10
MOSI: RPI_GPIO.19 ; also sheet 4,10
N$15: SOLENOIDS2.A2 SOLENOIDS2.B2
PT1_VS-: PT1/2.A2 PT1/2.B2 ; also sheet 3
PT2_VS-: PT1/2.A4 PT1/2.B4 ; also sheet 3
PT3_VS-: PT3/4.A2 PT3/4.B2 ; also sheet 3
PT4_VS-: PT3/4.A4 PT3/4.B4 ; also sheet 3
RELAY_NEGATIVE: SOL+RELAY.A1 SOL+RELAY.B1 ; also sheet 6
RPI_GPIO_1: RPI_GPIO.1
RPI_GPIO_3: RPI_GPIO.3
RPI_GPIO_4: RPI_GPIO.4
RPI_GPIO_5: RPI_GPIO.5
RPI_GPIO_7: RPI_GPIO.7
RPI_GPIO_8: RPI_GPIO.8
RPI_GPIO_9: RPI_GPIO.9
RPI_GPIO_10: RPI_GPIO.10
RPI_GPIO_12: RPI_GPIO.12
RPI_GPIO_14: RPI_GPIO.14
RPI_GPIO_17: RPI_GPIO.17
RPI_GPIO_20: RPI_GPIO.20
RPI_GPIO_25: RPI_GPIO.25
RPI_GPIO_27: RPI_GPIO.27
RPI_GPIO_28: RPI_GPIO.28
RPI_GPIO_29: RPI_GPIO.29
RPI_GPIO_30: RPI_GPIO.30
RPI_GPIO_31: RPI_GPIO.31
RPI_GPIO_32: RPI_GPIO.32
RPI_GPIO_33: RPI_GPIO.33
RPI_GPIO_34: RPI_GPIO.34
RPI_GPIO_35: RPI_GPIO.35
RPI_GPIO_36: RPI_GPIO.36
RPI_GPIO_37: RPI_GPIO.37
RPI_GPIO_38: RPI_GPIO.38
RPI_GPIO_39: RPI_GPIO.39
RPI_GPIO_40: RPI_GPIO.40
SCLK: RPI_GPIO.23 ; also sheet 4,10
SOLENOID_1_NEGATIVE: SOL+RELAY.A2 SOL+RELAY.B2 ; also sheet 5
SOLENOID_2_NEGATIVE: SOLENOIDS.A1 SOLENOIDS.B1 ; also sheet 5
SOLENOID_3_NEGATIVE: SOLENOIDS.A2 SOLENOIDS.B2 ; also sheet 5
SOLENOID_4_NEGATIVE: SOLENOIDS2.A1 SOLENOIDS2.B1 ; also sheet 5

### Notes on the sheet
- External Signal Connectors | External Power Connectors
- RPI GPIO
- TODO: Figure out how to properly distinguish these on the hardware board?
- NC
- TC_1
- TC_2
- TC_3
- TC_4 | DO NOT CONNECT

## Sheet 9 of 11: Load Cell Anti-Aliasing 2nd order Anti-Aliasing Butterworth filter for the load cells.
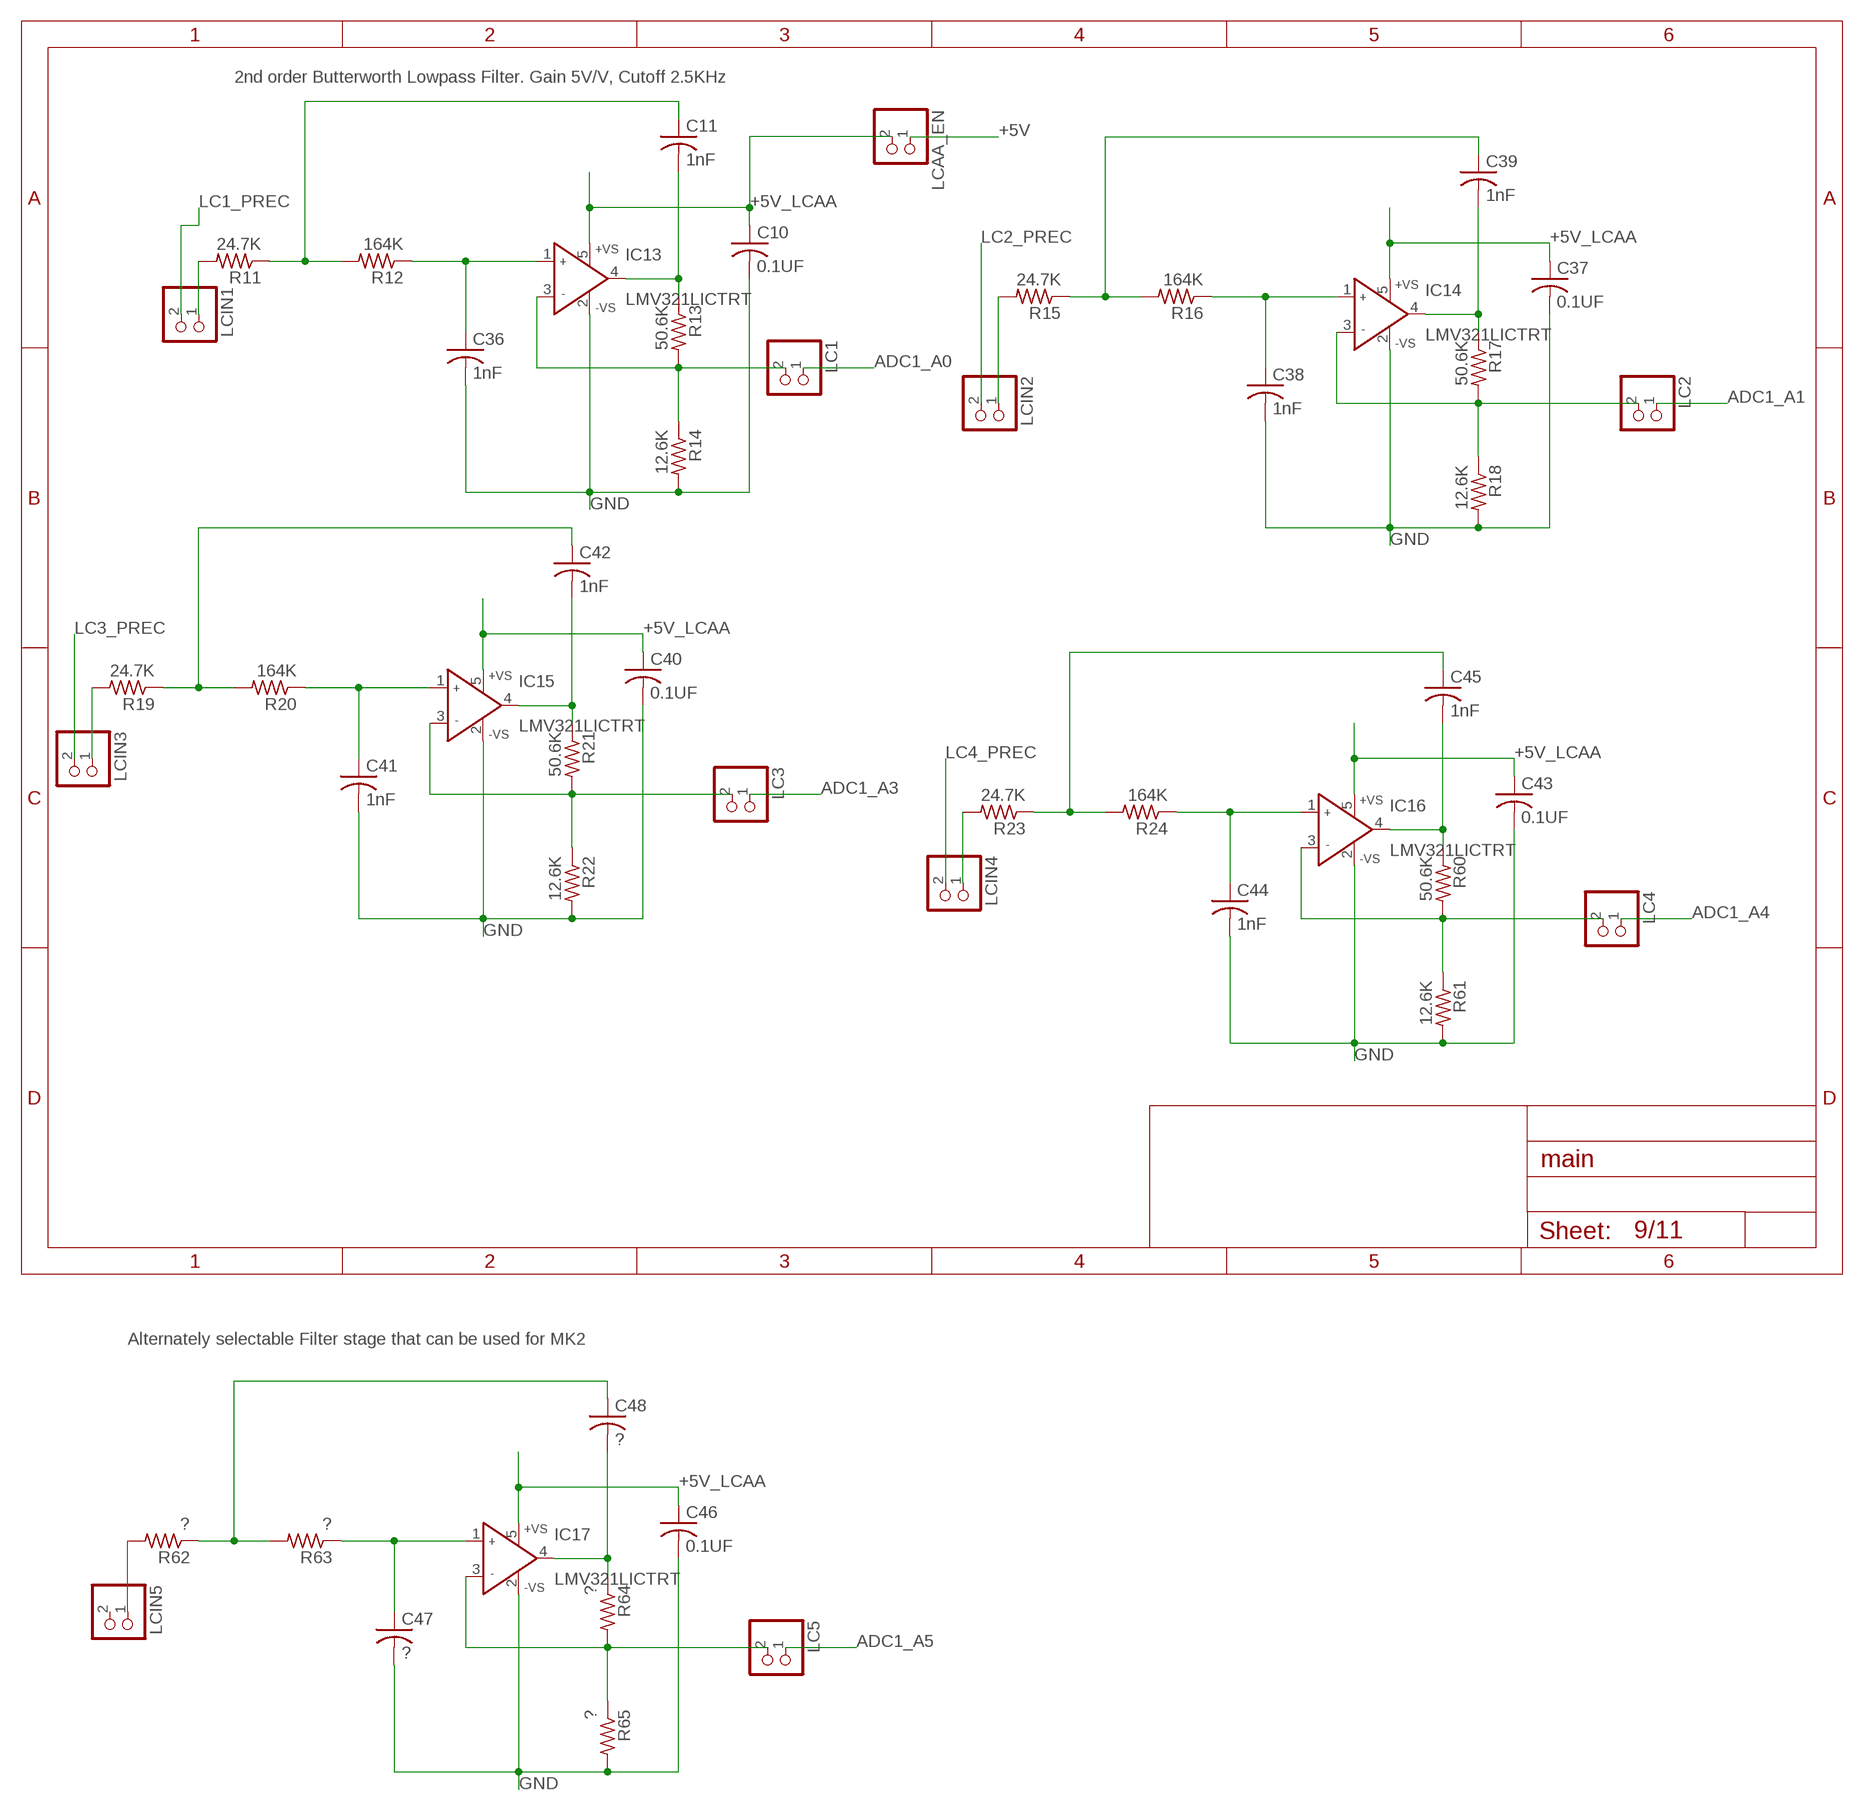
[diagram p8: schematic, sheet 9]

### Parts
C10  0.1UF  C-USC0805  [C0805]
C11  1nF  C-USC0805  [C0805]
C36  1nF  C-USC0805  [C0805]
C37  0.1UF  C-USC0805  [C0805]
C38  1nF  C-USC0805  [C0805]
C39  1nF  C-USC0805  [C0805]
C40  0.1UF  C-USC0805  [C0805]
C41  1nF  C-USC0805  [C0805]
C42  1nF  C-USC0805  [C0805]
C43  0.1UF  C-USC0805  [C0805]
C44  1nF  C-USC0805  [C0805]
C45  1nF  C-USC0805  [C0805]
C46  0.1UF  C-USC0805  [C0805]
C47  ?  C-USC0805  [C0805]
C48  ?  C-USC0805  [C0805]
IC13  LMV321LICTRT  [SOT23-5]
IC14  LMV321LICTRT  [SOT23-5]
IC15  LMV321LICTRT  [SOT23-5]
IC16  LMV321LICTRT  [SOT23-5]
IC17  LMV321LICTRT  [SOT23-5]
LC1  PINHD-1X2  [1X02]
LC2  PINHD-1X2  [1X02]
LC3  PINHD-1X2  [1X02]
LC4  PINHD-1X2  [1X02]
LC5  PINHD-1X2  [1X02]
LCAA_EN  PINHD-1X2  [1X02]
LCIN1  PINHD-1X2  [1X02]
LCIN2  PINHD-1X2  [1X02]
LCIN3  PINHD-1X2  [1X02]
LCIN4  PINHD-1X2  [1X02]
LCIN5  PINHD-1X2  [1X02]
R11  24.7K  R-US_R0805  [R0805]
R12  164K  R-US_R0805  [R0805]
R13  50.6K  R-US_R0805  [R0805]
R14  12.6K  R-US_R0805  [R0805]
R15  24.7K  R-US_R0805  [R0805]
R16  164K  R-US_R0805  [R0805]
R17  50.6K  R-US_R0805  [R0805]
R18  12.6K  R-US_R0805  [R0805]
R19  24.7K  R-US_R0805  [R0805]
R20  164K  R-US_R0805  [R0805]
R21  50.6K  R-US_R0805  [R0805]
R22  12.6K  R-US_R0805  [R0805]
R23  24.7K  R-US_R0805  [R0805]
R24  164K  R-US_R0805  [R0805]
R60  50.6K  R-US_R0805  [R0805]
R61  12.6K  R-US_R0805  [R0805]
R62  ?  R-US_R0805  [R0805]
R63  ?  R-US_R0805  [R0805]
R64  ?  R-US_R0805  [R0805]
R65  ?  R-US_R0805  [R0805]

### Nets
+5V: LCAA_EN.1 ; also sheet 1,7,8,10
+5V_LCAA: C10.1 C37.1 C40.1 C43.1 C46.1 IC13.5(+VS) IC14.5(+VS) IC15.5(+VS) IC16.5(+VS) IC17.5(+VS) LCAA_EN.2
ADC1_A0: LC1.1 ; also sheet 4,10
ADC1_A1: LC2.1 ; also sheet 4,10
ADC1_A3: LC3.1 ; also sheet 4,10
ADC1_A4: LC4.1 ; also sheet 4,10
ADC1_A5: LC5.1 ; also sheet 4,10
GND: C10.2 C36.2 C37.2 C38.2 C40.2 C41.2 C43.2 C44.2 C46.2 C47.2 IC13.2(-VS) IC14.2(-VS) IC15.2(-VS) IC16.2(-VS) IC17.2(-VS) R14.2 R18.2 R22.2 R61.2 R65.2 ; also sheet 1,2,3,4,5,6,7,8,10
LC1_PREC: LCIN1.2 ; also sheet 2
LC2_PREC: LCIN2.2 ; also sheet 2
LC3_PREC: LCIN3.2 ; also sheet 2
LC4_PREC: LCIN4.2 ; also sheet 2
N$13: C11.1 R11.1 R12.2
N$16: C36.1 IC13.1(IN+) R12.1
N$17: C39.1 R15.1 R16.2
N$18: C11.2 IC13.4(OUT) R13.1
N$19: C38.1 IC14.1(IN+) R16.1
N$20: C39.2 IC14.4(OUT) R17.1
N$23: IC14.3(IN-) LC2.2 R17.2 R18.1
N$24: C42.1 R19.1 R20.2
N$38: C41.1 IC15.1(IN+) R20.1
N$40: C42.2 IC15.4(OUT) R21.1
N$44: IC15.3(IN-) LC3.2 R21.2 R22.1
N$45: C45.1 R23.1 R24.2
N$48: C44.1 IC16.1(IN+) R24.1
N$49: C45.2 IC16.4(OUT) R60.1
N$50: IC13.3(IN-) LC1.2 R13.2 R14.1
N$51: IC16.3(IN-) LC4.2 R60.2 R61.1
N$52: LCIN1.1 R11.2
N$53: LCIN2.1 R15.2
N$54: LCIN3.1 R19.2
N$55: LCIN4.1 R23.2
N$56: C48.1 R62.1 R63.2
N$57: C47.1 IC17.1(IN+) R63.1
N$58: C48.2 IC17.4(OUT) R64.1
N$59: IC17.3(IN-) LC5.2 R64.2 R65.1
N$60: LCIN5.1 R62.2
Unconnected: LCIN5.2

### Notes on the sheet
- 2nd order Butterworth Lowpass Filter. Gain 5V/V, Cutoff 2.5KHz
- Alternately selectable Filter stage that can be used for MK2

## Sheet 10 of 11: Debug Pins Used for debugging outputs.
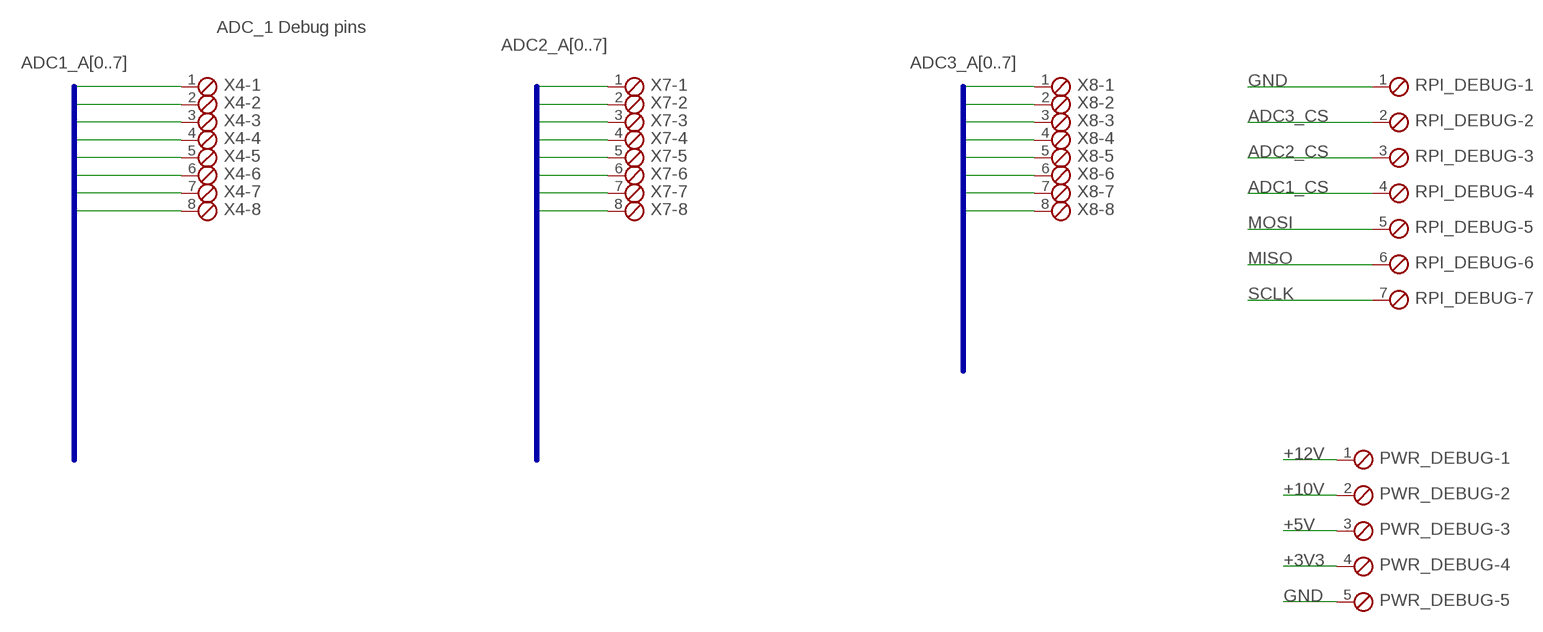
[diagram p9: schematic, sheet 10]

### Parts
PWR_DEBUG  MPT5  [5POL254]
RPI_DEBUG  MPT7  [7POL254]
X4  MPT8  [8POL254]
X7  MPT8  [8POL254]
X8  MPT8  [8POL254]

### Nets
+3V3: PWR_DEBUG.4 ; also sheet 1,2,3,4,8
+5V: PWR_DEBUG.3 ; also sheet 1,7,8,9
+10V: PWR_DEBUG.2 ; also sheet 1,3,8
+12V: PWR_DEBUG.1 ; also sheet 1,5,6,8
ADC1_A0: X4.1 ; also sheet 4,9
ADC1_A1: X4.2 ; also sheet 4,9
ADC1_A2: X4.3 ; also sheet 4
ADC1_A3: X4.4 ; also sheet 4,9
ADC1_A4: X4.5 ; also sheet 4,9
ADC1_A5: X4.6 ; also sheet 4,9
ADC1_A6: X4.7 ; also sheet 4
ADC1_A7: X4.8 ; also sheet 4
ADC1_CS: RPI_DEBUG.4 ; also sheet 4,8
ADC2_A0: X7.1 ; also sheet 4,7
ADC2_A1: X7.2 ; also sheet 4,7
ADC2_A2: X7.3 ; also sheet 4,7
ADC2_A3: X7.4 ; also sheet 4,7
ADC2_A4: X7.5 ; also sheet 4,8
ADC2_A5: X7.6 ; also sheet 4,8
ADC2_A6: X7.7 ; also sheet 4,8
ADC2_A7: X7.8 ; also sheet 4,8
ADC2_CS: RPI_DEBUG.3 ; also sheet 4,8
ADC3_A0: X8.1 ; also sheet 4
ADC3_A1: X8.2 ; also sheet 4
ADC3_A2: X8.3 ; also sheet 4
ADC3_A3: X8.4 ; also sheet 4
ADC3_A4: X8.5 ; also sheet 4
ADC3_A5: X8.6 ; also sheet 4
ADC3_A6: X8.7 ; also sheet 4
ADC3_A7: X8.8 ; also sheet 4
ADC3_CS: RPI_DEBUG.2 ; also sheet 4,8
GND: PWR_DEBUG.5 RPI_DEBUG.1 ; also sheet 1,2,3,4,5,6,7,8,9
MISO: RPI_DEBUG.6 ; also sheet 4,8
MOSI: RPI_DEBUG.5 ; also sheet 4,8
SCLK: RPI_DEBUG.7 ; also sheet 4,8

### Buses
ADC1_A[0..7]
ADC2_A[0..7]
ADC3_A[0..7]

### Notes on the sheet
- ADC_1 Debug pins

## Sheet 11 of 11: Pin Assignments This sheet will be used to connect nets that are named such as ADC1_1 to LC1+ using junctions and shorts. For now it does not have a sheet border. I am unsure if it should have such a border.

## Library data of the parts
3.3V_REG = diodes-extra:AP2210N-3.3TRG1: 3.3V regulator 300mA rating.
5V_REG = texas-extra:LM1084ISX-5.0/NOPB; MANUFACTURER_PART_NUMBER: LM1084ISX5.0NOPB; VENDOR: Texas Instruments
10V_REG = texas-extra:UA78M*: POSITIVE-VOLTAGE REGULATORS Source: http://focus.ti.com/lit/ds/symlink/ua78m33.pdf
+3.3V_LED +5V_LED +10V_LED +12V_LED = led:LED: LED OSRAM: - CHIPLED LG R971, LG N971, LY N971, LG Q971, LY Q971, LO R971, LY R971 LH N974, LH R974 LS Q976, LO Q976, LY Q976 LO Q996 - Hyper CHIPLED LW Q18S LB Q993, LB Q99A, LB R99A - SideLED LS A670, LO A670, LY A670, LG A670, LP A670 LB A673, LV A673, LT A673, LW A673 LH A674 LY A675 LS A676, LA A676, LO A676, LY A676, LW A676 LS A679, LY A679, LG A679 - Hyper Micro SIDELED® LS Y876, LA Y876, LO Y876, LY Y876 LT Y87S - SmartLED LW L88C, LW L88S LB L89C, LB L89S, LG L890 LS L89K, LO L89K, LY L89K LS L896, LA L896, LO L896, LY L896 - TOPLED LS T670, LO T670, LY T670, LG T670, LP T670 LSG T670, LSP T670, LSY T670, LOP T670, LYG T670 LG T671, LOG T671, LSG T671 LB T673, LV T673, LT T673, LW T673 LH T674 LS T676, LA T676, LO T676, LY T676, LB T676, LH T676, LSB T676, LW T676 LB T67C, LV T67C, LT T67C, LS T67K, LO T67K, LY T67K, LW E67C LS E67B, LA E67B, LO E67B, LY E67B, LB E67C, LV E67C, LT E67C LW T67C LS T679, LY T679, LG T679 LS T770, LO T770, LY T770, LG T770, LP T770 LB T773, LV T773, LT T773, LW T773 LH T774 LS E675, LA E675, LY E675, LS T675 LS T776, LA T776, LO T776, LY T776, LB T776 LHGB T686 LT T68C, LB T68C - Hyper Mini TOPLED® LB M676 - Mini TOPLED Santana® LG M470 LS M47K, LO M47K, LY M47K Source: http://www.osram.convergy.de LUXEON: - LUMILED® LXK2-PW12-R00, LXK2-PW12-S00, LXK2-PW14-U00, LXK2-PW14-V00 LXK2-PM12-R00, LXK2-PM12-S00, LXK2-PM14-U00 LXK2-PE12-Q00, LXK2-PE12-R00, LXK2-PE12-S00, LXK2-PE14-T00, LXK2-PE14-U00 LXK2-PB12-K00, LXK2-PB12-L00, LXK2-PB12-M00, LXK2-PB14-N00, LXK2-PB14-P00, LXK2-PB14-Q00 LXK2-PR12-L00, LXK2-PR12-M00, LXK2-PR14-Q00, LXK2-PR14-R00 LXK2-PD12-Q00, LXK2-PD12-R00, LXK2-PD12-S00 LXK2-PH12-R00, LXK2-PH12-S00 LXK2-PL12-P00, LXK2-PL12-Q00, LXK2-PL12-R00 Source: www.luxeon.com KINGBRIGHT: KA-3528ASYC Source: www.kingbright.com
ADC1-ADC3 = microchip-extra:MCP3208: 2.7V Dual Channel 12-Bit A/D Converter with SPI Serial Interface Source: http://ww1.microchip.com/downloads/en/DeviceDoc/21034D.pdf; MF: MICROCHIP; MPN: MCP3202-CI/SN; OC_FARNELL: 1196803; OC_NEWARK: 19C7207
C1-C3 C8-C12 C14 C15 C18-C30 C32 C34 C36-C48 = rcl:C-US: CAPACITOR, American symbol; SPICEPREFIX: C
C4-C7 C16 C17 = rcl:CPOL-US: POLARIZED CAPACITOR, American symbol
D1-D4 D6 = diode:1N4004: DIODE general purpose rectifier, 1 A
D5 = diode:DIODE-: DIODE
IC1-IC4 IC6-IC9 IC13-IC17 = st-microelectronics-extra:LMV321LICT: High Performance, 145 MHz FastFET Op Amps Source: http://www.analog.com/static/imported-files/data_sheets/AD8065_8066.pdf; MF: ALTERA CORPORATION; MPN: AD8065ARTZ-REEL7; OC_FARNELL: 1464845; OC_NEWARK: 59K6316
IC5 IC10-IC12 = microchip-extra:MCP6N11: Low Cost, Low Power, Instrumentation Amplifier Source: http://www.analog.com/UploadedFiles/Data_Sheets/37793330023930AD620_e.pdf; MPN: AD620AR; OC_FARNELL: 1464424; OC_NEWARK: 05F7109
JP1 JP2 JP4 LC1-LC5 LC_EN/CAL LCAA_EN LCIN1-LCIN5 = pinhead:PINHD-1X2: PIN HEADER
LC1/2 LC3/4 PT1/2 PT3/4 THERMOCOUPLES = con-phoenix-500-extra:1991118
PWR_DEBUG = con-phoenix-254:MPT5: PHOENIX CONNECTOR; OC_FARNELL: unknown; OC_NEWARK: unknown
PWR_IN PWR_OUT1 PWR_OUT2 SOL+RELAY SOLENOIDS SOLENOIDS2 = con-phoenix-500-extra:1991095
R1-R25 R29-R34 R36-R65 RF1-RF4 RG1-RG4 RPD1 = rcl:R-US_: RESISTOR, American symbol
R26-R28 R35 = resistor:R-US_: RESISTOR, American symbol
RPI_DEBUG = con-phoenix-254:MPT7: PHOENIX CONNECTOR; OC_FARNELL: unknown; OC_NEWARK: unknown
RPI_GPIO = con-3m:2540-: 3M (TM) Pak 100 4-Wall Header Source: 3M; OC_FARNELL: 9838414; OC_NEWARK: unknown
RZ1-RZ4 = pot:TRIM_US-: POTENTIOMETER
U6 = SLIDE_SW:1101M2S3CQE2; COPYRIGHT: Copyright (C) 2015 Accelerated Designs. All rights reserved; MANUFACTURER_PART_NUMBER: 1101M2S3CQE2; VENDOR: C&K
U$2 U$3 U$8 U$9 = transistor-fet-extra:2N7000
U$5 = transistor-power:IRF740: N-CHANNEL MOS FET
X4 X7 X8 = con-phoenix-254:MPT8: PHOENIX CONNECTOR; OC_FARNELL: unknown; OC_NEWARK: unknown